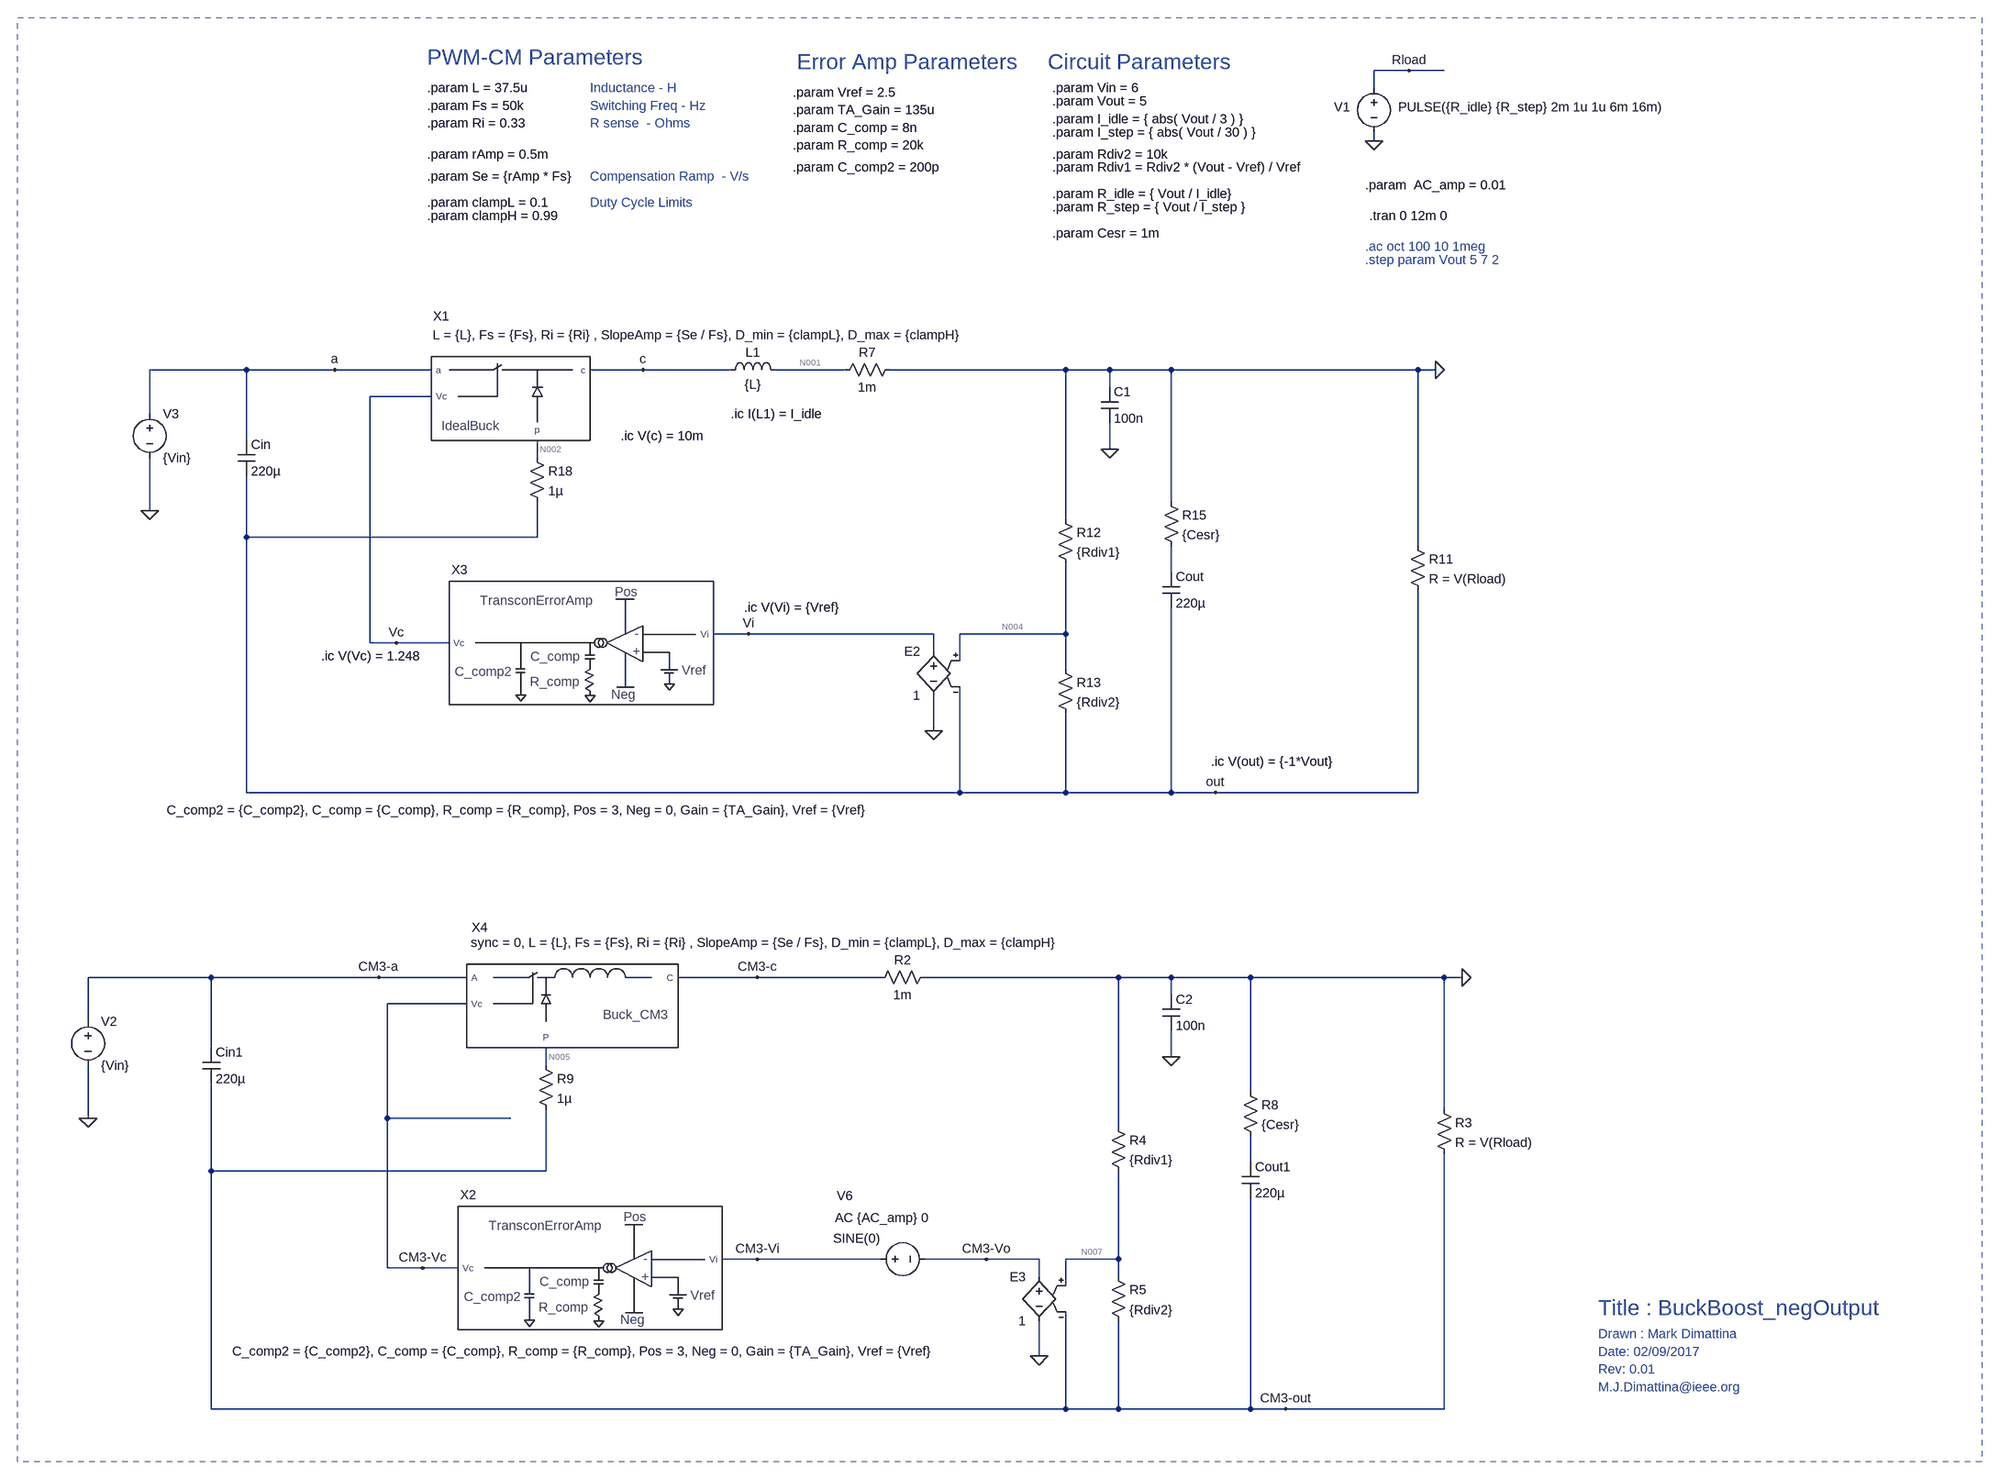
[diagram p0: schematic BuckBoost_negOutput.asc]
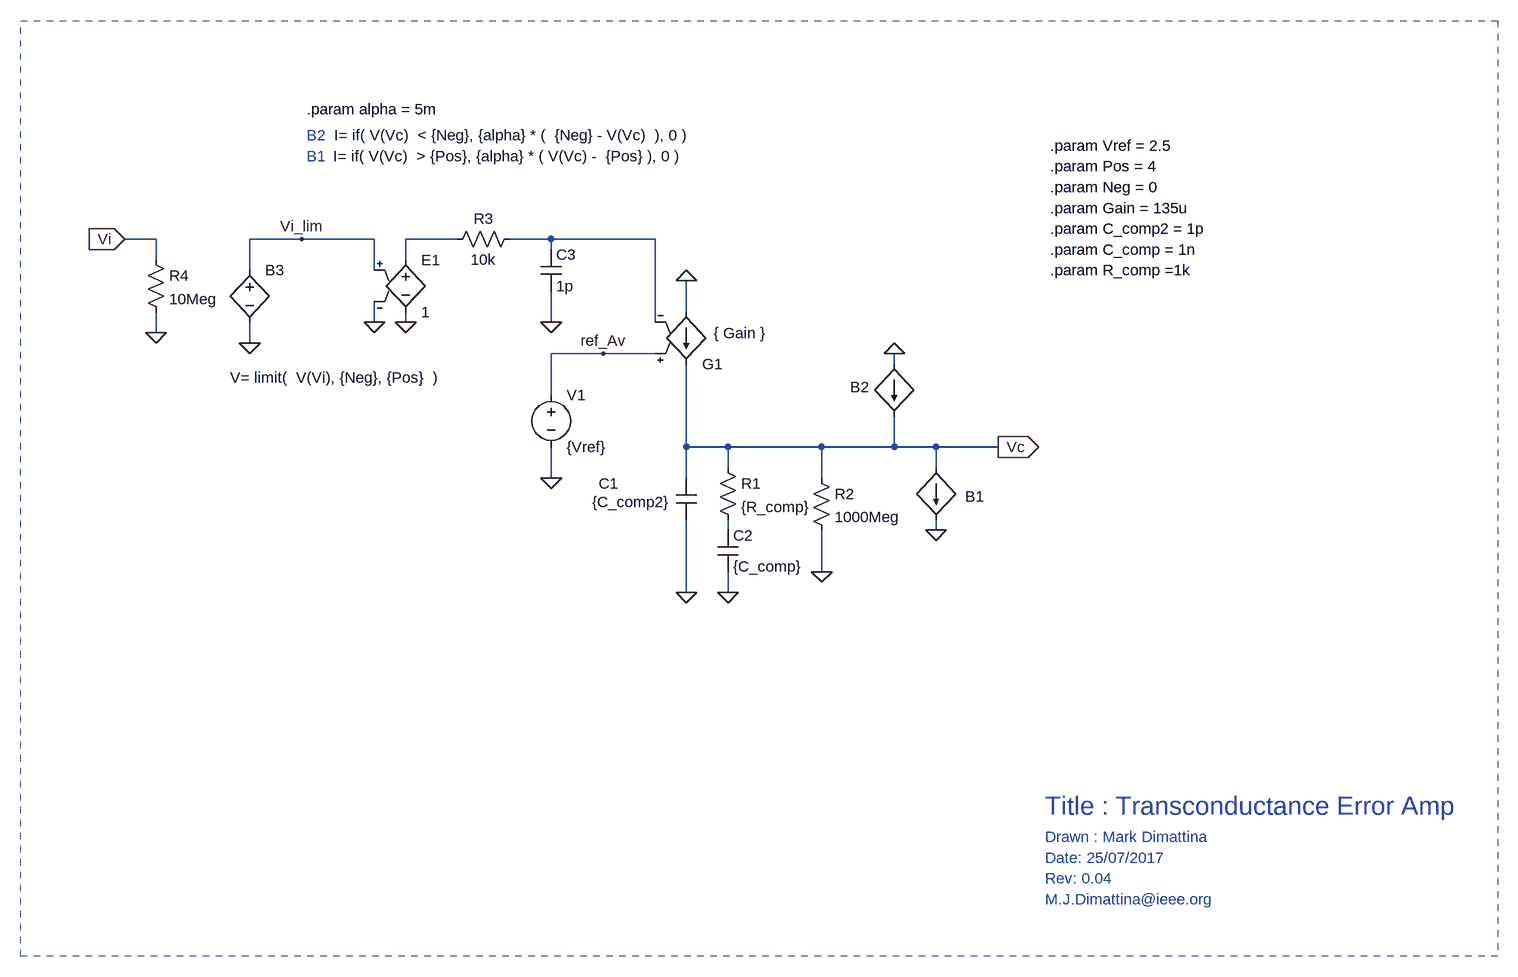
[diagram p1: sub-circuit transconerroramp.asc]
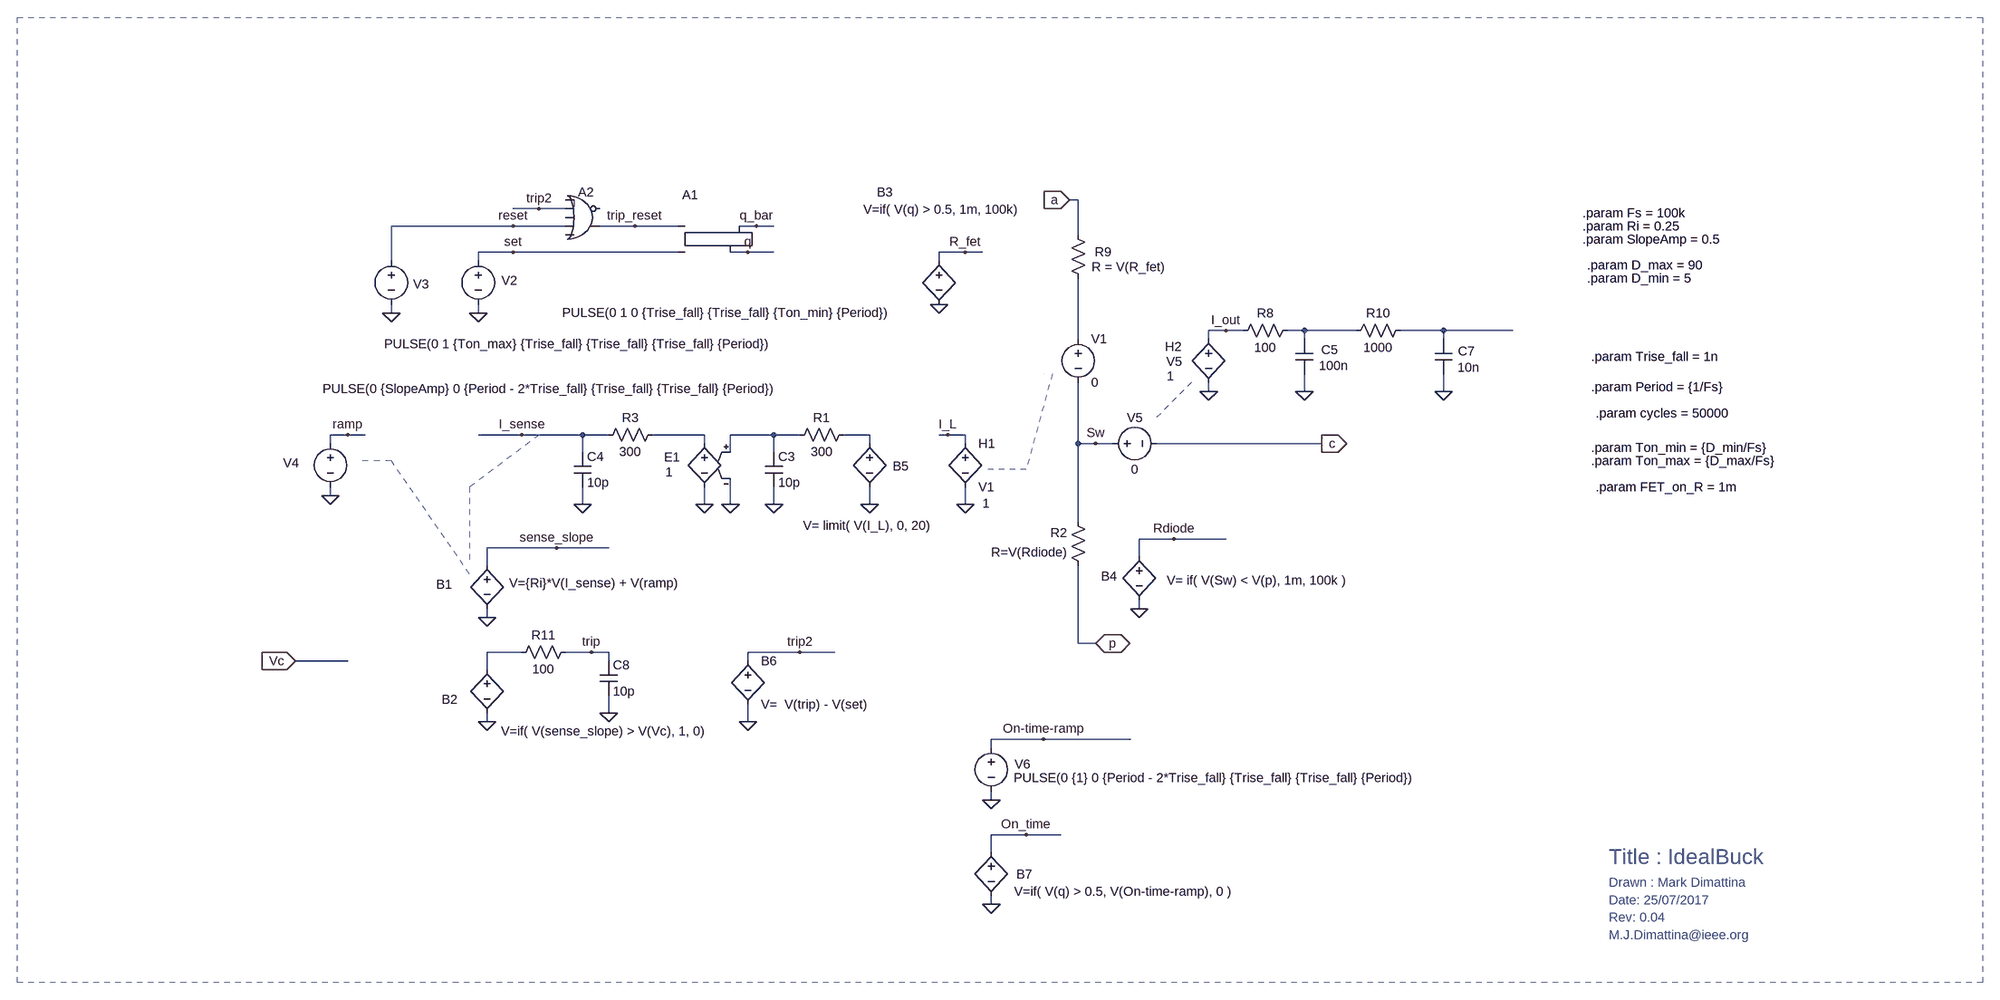
[diagram p2: sub-circuit idealbuck.asc]
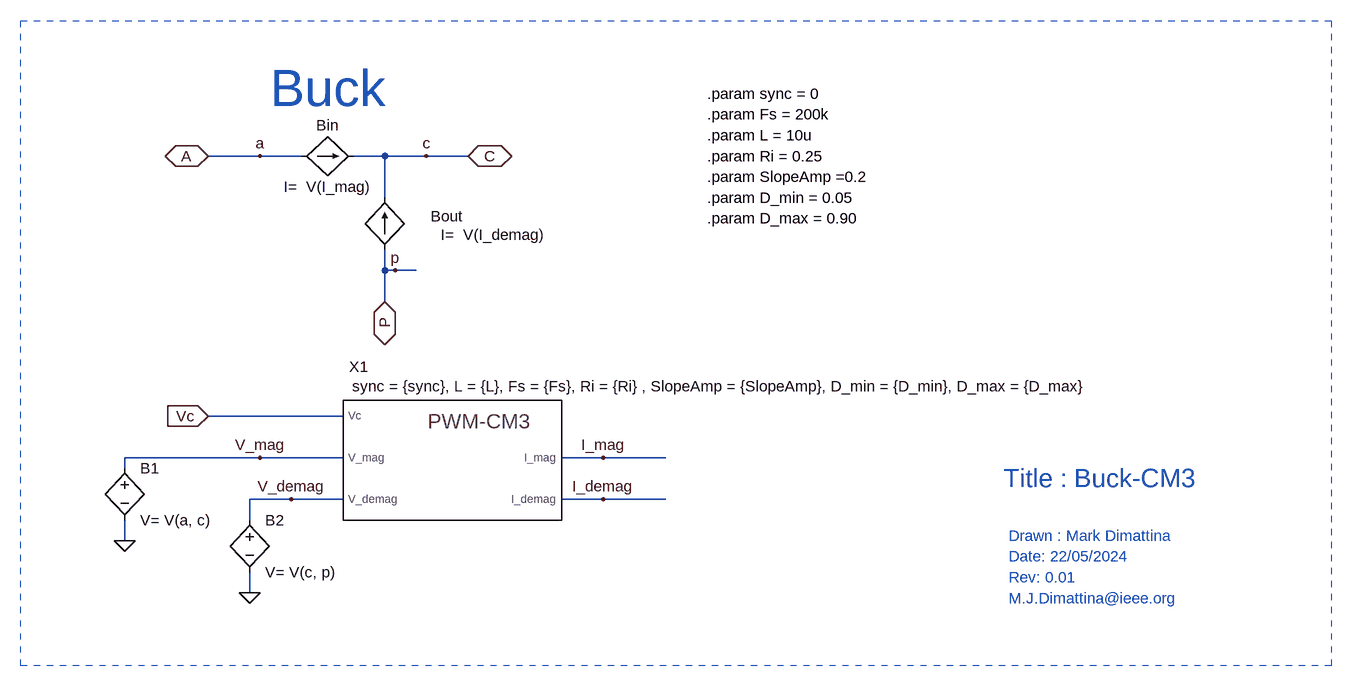
[diagram p3: sub-circuit buck_cm3.asc]
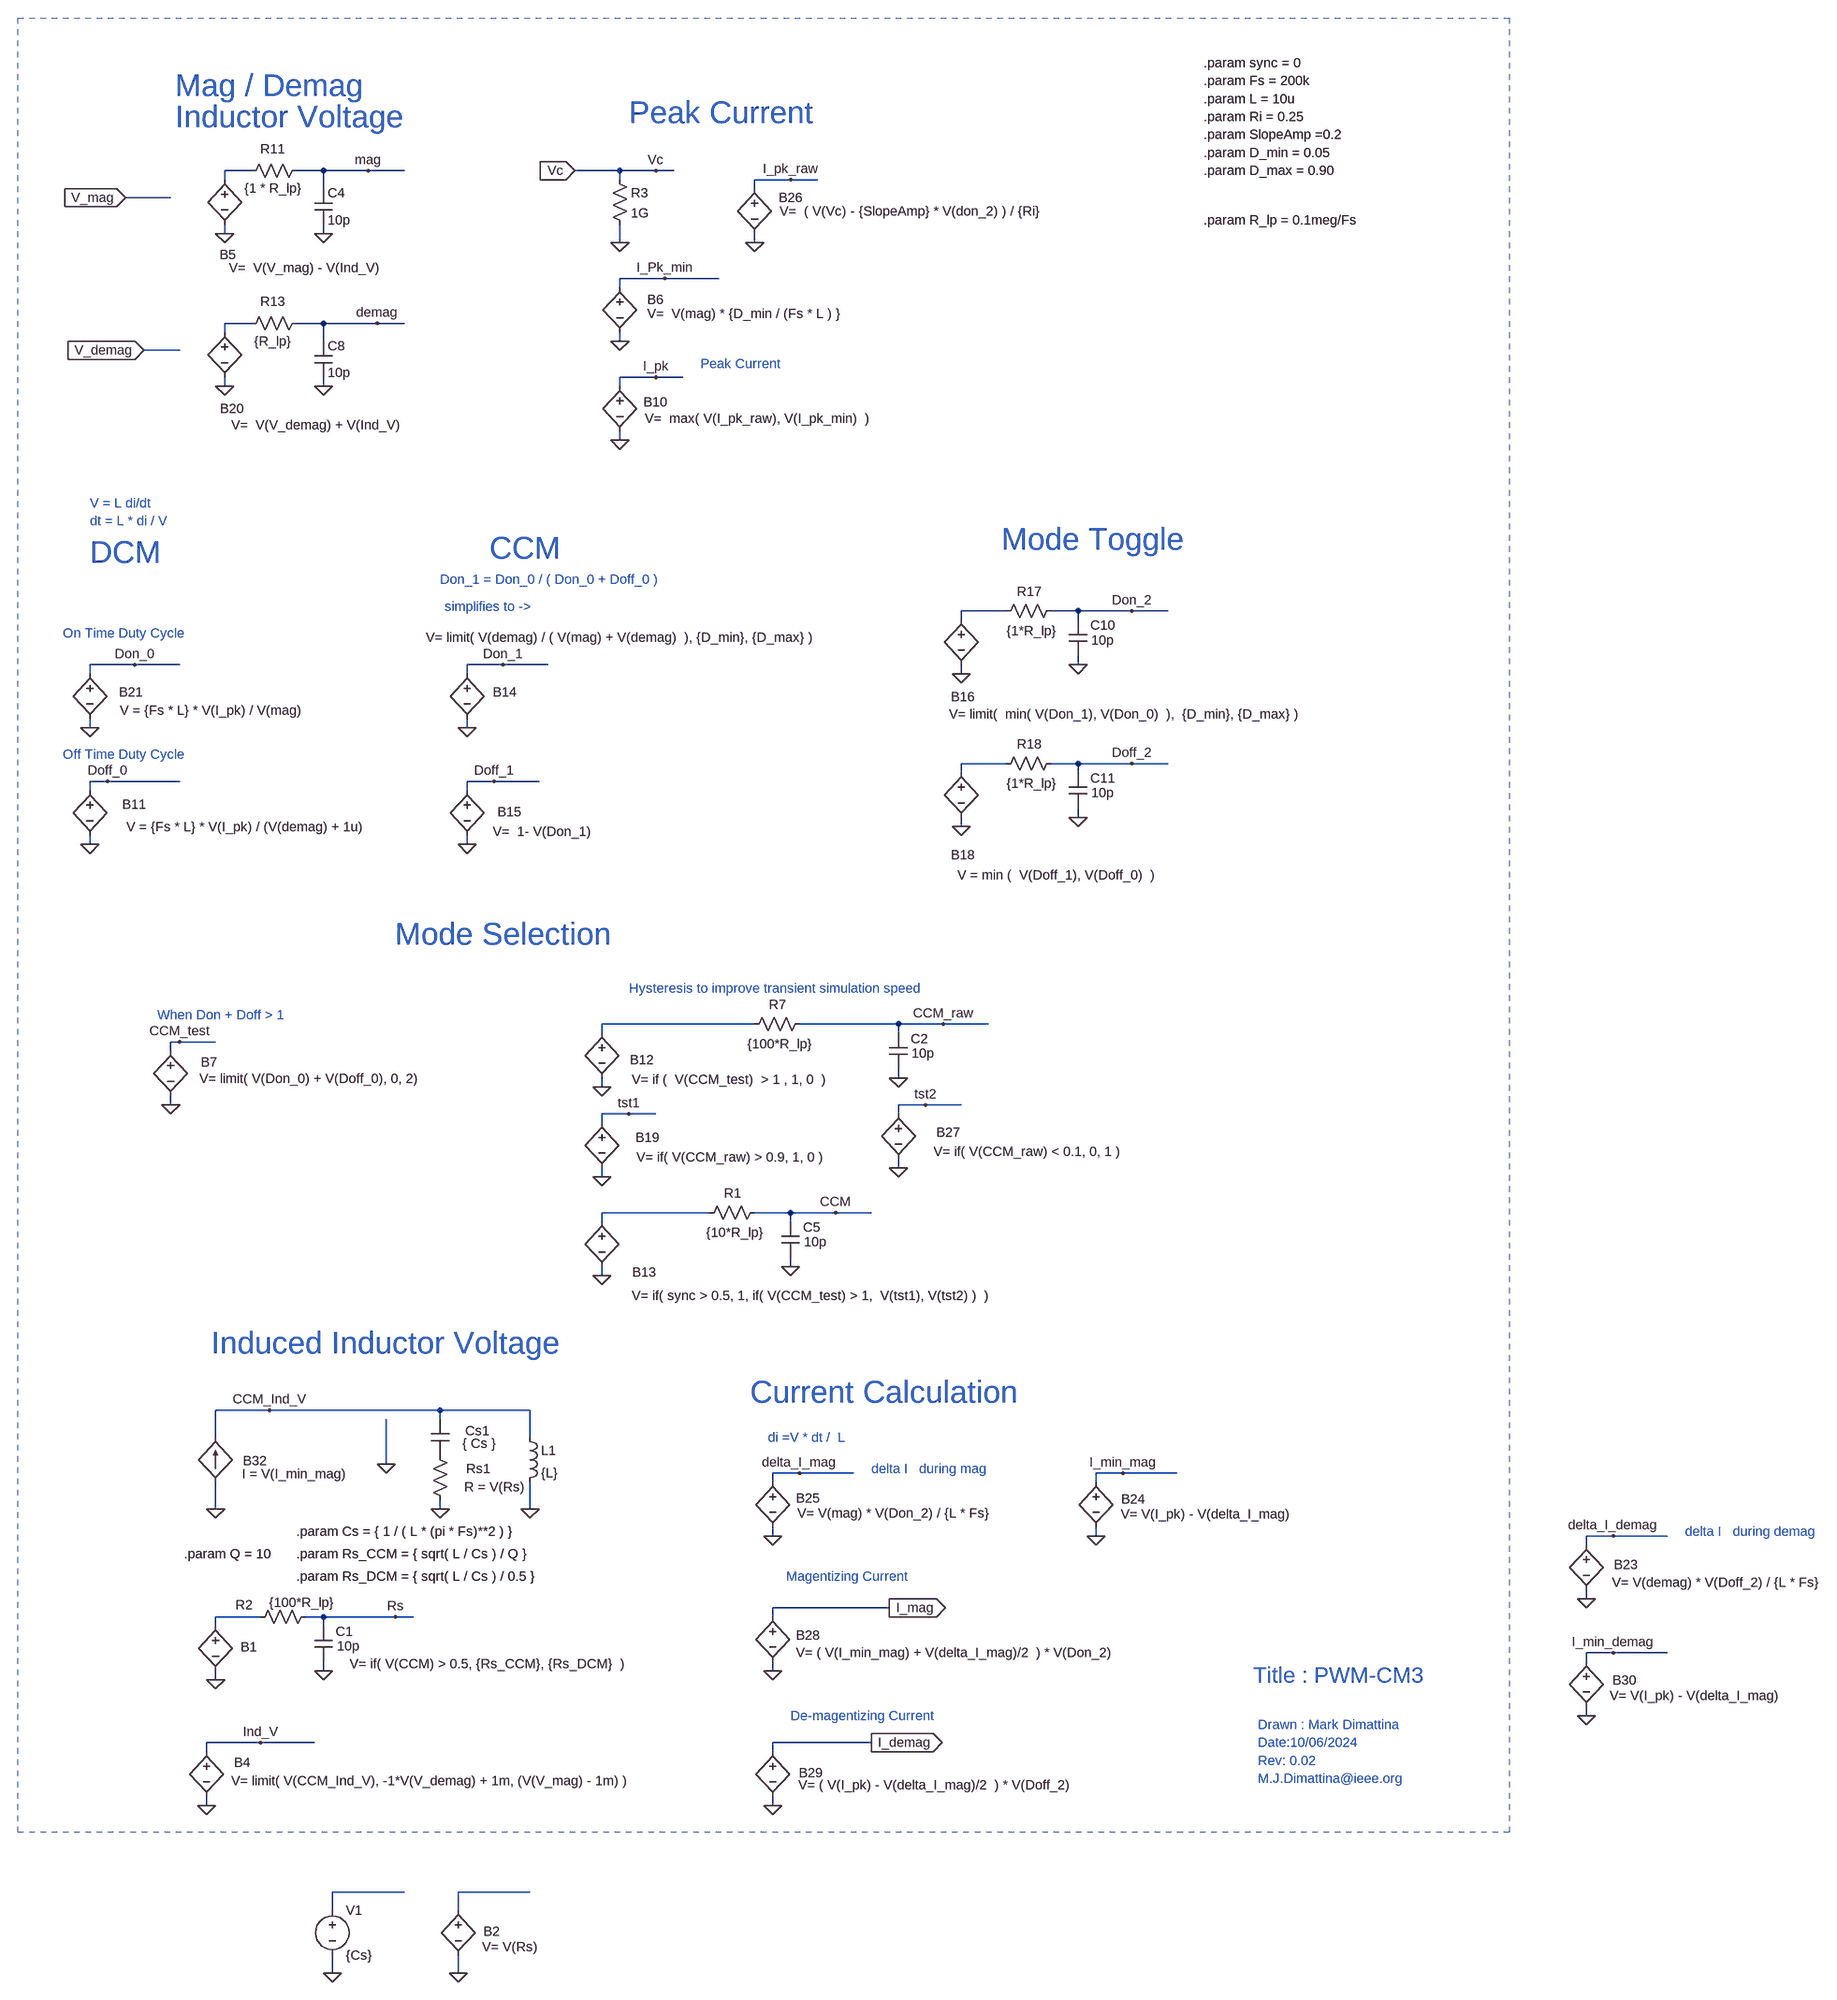
[diagram p4: sub-circuit pwm_cm3.asc]
BuckBoost_negOutput.asc, the LTspice schematic file:
Version 4
SHEET 1 6372 4964
WIRE 2976 864 2912 864
WIRE 3040 864 2976 864
WIRE 2912 896 2912 864
WIRE 2912 992 2912 976
WIRE 864 1408 688 1408
WIRE 1024 1408 864 1408
WIRE 1200 1408 1024 1408
WIRE 1584 1408 1488 1408
WIRE 1744 1408 1584 1408
WIRE 1952 1408 1824 1408
WIRE 2352 1408 2032 1408
WIRE 2432 1408 2352 1408
WIRE 2544 1408 2432 1408
WIRE 2992 1408 2544 1408
WIRE 3024 1408 2992 1408
WIRE 2432 1440 2432 1408
WIRE 1200 1456 1088 1456
WIRE 688 1488 688 1408
WIRE 864 1536 864 1408
WIRE 2432 1552 2432 1504
WIRE 1392 1568 1392 1536
WIRE 2544 1648 2544 1408
WIRE 688 1664 688 1568
WIRE 2352 1680 2352 1408
WIRE 864 1712 864 1600
WIRE 1392 1712 1392 1648
WIRE 1392 1712 864 1712
WIRE 2992 1728 2992 1408
WIRE 2544 1776 2544 1728
WIRE 1776 1888 1712 1888
WIRE 2112 1888 1776 1888
WIRE 2352 1888 2352 1760
WIRE 2352 1888 2160 1888
WIRE 1088 1904 1088 1456
WIRE 1136 1904 1088 1904
WIRE 1232 1904 1136 1904
WIRE 2112 1920 2112 1888
WIRE 2160 1936 2160 1888
WIRE 2352 1952 2352 1888
WIRE 2112 2064 2112 2000
WIRE 864 2176 864 1712
WIRE 2160 2176 2160 1984
WIRE 2160 2176 864 2176
WIRE 2352 2176 2352 2032
WIRE 2352 2176 2160 2176
WIRE 2544 2176 2544 1840
WIRE 2544 2176 2352 2176
WIRE 2624 2176 2544 2176
WIRE 2992 2176 2992 1808
WIRE 2992 2176 2624 2176
WIRE 800 2512 576 2512
WIRE 1104 2512 800 2512
WIRE 1264 2512 1104 2512
WIRE 1792 2512 1648 2512
WIRE 2016 2512 1792 2512
WIRE 2448 2512 2096 2512
WIRE 2544 2512 2448 2512
WIRE 2688 2512 2544 2512
WIRE 3040 2512 2688 2512
WIRE 3072 2512 3040 2512
WIRE 2544 2544 2544 2512
WIRE 1264 2560 1120 2560
WIRE 576 2592 576 2512
WIRE 800 2640 800 2512
WIRE 2544 2656 2544 2608
WIRE 1408 2672 1408 2640
WIRE 2688 2720 2688 2512
WIRE 3040 2752 3040 2512
WIRE 576 2768 576 2672
WIRE 1120 2768 1120 2560
WIRE 1344 2768 1120 2768
WIRE 2448 2784 2448 2512
WIRE 2688 2848 2688 2800
WIRE 800 2864 800 2704
WIRE 1408 2864 1408 2752
WIRE 1408 2864 800 2864
WIRE 1792 3024 1728 3024
WIRE 2016 3024 1792 3024
WIRE 2208 3024 2096 3024
WIRE 2304 3024 2208 3024
WIRE 2448 3024 2448 2864
WIRE 2448 3024 2352 3024
WIRE 1120 3040 1120 2768
WIRE 1184 3040 1120 3040
WIRE 1248 3040 1184 3040
WIRE 2304 3056 2304 3024
WIRE 2448 3056 2448 3024
WIRE 2352 3072 2352 3024
WIRE 2304 3200 2304 3136
WIRE 800 3296 800 2864
WIRE 2352 3296 2352 3120
WIRE 2352 3296 800 3296
WIRE 2448 3296 2448 3136
WIRE 2448 3296 2352 3296
WIRE 2688 3296 2688 2912
WIRE 2688 3296 2448 3296
WIRE 2752 3296 2688 3296
WIRE 3040 3296 3040 2832
WIRE 3040 3296 2752 3296
FLAG 1024 1408 a
FLAG 2624 2176 out
FLAG 688 1664 0
FLAG 1136 1904 Vc
FLAG 1776 1888 Vi
FLAG 2432 1552 0
FLAG 2912 992 0
FLAG 2976 864 Rload
FLAG 2112 2064 0
FLAG 3024 1408 0
FLAG 1104 2512 CM3-a
FLAG 2752 3296 CM3-out
FLAG 576 2768 0
FLAG 1184 3040 CM3-Vc
FLAG 1792 3024 CM3-Vi
FLAG 2544 2656 0
FLAG 1792 2512 CM3-c
FLAG 2304 3200 0
FLAG 3072 2512 0
FLAG 2208 3024 CM3-Vo
FLAG 1584 1408 c
DATAFLAG 1264 2768 ""
DATAFLAG 2912 3296 ""
SYMBOL ind 1728 1424 R270
WINDOW 0 32 56 VTop 2
WINDOW 3 5 56 VBottom 2
SYMATTR InstName L1
SYMATTR Value {L}
SYMATTR SpiceLine Rser=1m
SYMBOL res 2048 1392 R90
WINDOW 0 0 56 VBottom 2
WINDOW 3 32 56 VTop 2
SYMATTR InstName R7
SYMATTR Value 1m
SYMBOL cap 2528 1776 R0
SYMATTR InstName Cout
SYMATTR Value 220µ
SYMBOL res 2976 1712 R0
SYMATTR InstName R11
SYMATTR Value R = V(Rload)
SYMBOL res 2336 1664 R0
SYMATTR InstName R12
SYMATTR Value {Rdiv1}
SYMBOL res 2336 1936 R0
SYMATTR InstName R13
SYMATTR Value {Rdiv2}
SYMBOL voltage 688 1472 R0
SYMATTR InstName V3
SYMATTR Value {Vin}
SYMBOL res 2528 1632 R0
SYMATTR InstName R15
SYMATTR Value {Cesr}
SYMBOL TransconErrorAmp 1616 1824 M0
WINDOW 0 380 -53 Right 2
WINDOW 39 897 384 Right 2
SYMATTR InstName X3
SYMATTR SpiceLine C_comp2 = {C_comp2}, C_comp = {C_comp}, R_comp = {R_comp}, Pos = 3, Neg = 0, Gain = {TA_Gain}, Vref = {Vref}
SYMBOL cap 2416 1440 R0
SYMATTR InstName C1
SYMATTR Value 100n
SYMBOL voltage 2912 880 R0
WINDOW 123 0 0 Left 2
WINDOW 39 0 0 Left 2
WINDOW 0 -72 51 Left 2
WINDOW 3 44 51 Left 2
SYMATTR InstName V1
SYMATTR Value PULSE({R_idle} {R_step} 2m 1u 1u 6m 16m)
SYMBOL res 1376 1552 R0
SYMATTR InstName R18
SYMATTR Value 1µ
SYMBOL IdealBuck 1296 1440 R0
WINDOW 0 -78 -114 Bottom 2
WINDOW 39 -94 -95 Left 2
SYMATTR InstName X1
SYMATTR SpiceLine L = {L}, Fs = {Fs}, Ri = {Ri} , SlopeAmp = {Se / Fs}, D_min = {clampL}, D_max = {clampH}
SYMBOL e 2112 1904 M0
SYMATTR InstName E2
SYMATTR Value 1
SYMBOL cap 848 1536 R0
SYMATTR InstName Cin
SYMATTR Value 220µ
SYMBOL res 2112 2496 R90
WINDOW 0 0 56 VBottom 2
WINDOW 3 32 56 VTop 2
SYMATTR InstName R2
SYMATTR Value 1m
SYMBOL cap 2672 2848 R0
SYMATTR InstName Cout1
SYMATTR Value 220µ
SYMBOL res 3024 2736 R0
SYMATTR InstName R3
SYMATTR Value R = V(Rload)
SYMBOL res 2432 2768 R0
SYMATTR InstName R4
SYMATTR Value {Rdiv1}
SYMBOL res 2432 3040 R0
SYMATTR InstName R5
SYMATTR Value {Rdiv2}
SYMBOL voltage 576 2576 R0
SYMATTR InstName V2
SYMATTR Value {Vin}
SYMBOL res 2672 2704 R0
SYMATTR InstName R8
SYMATTR Value {Cesr}
SYMBOL res 1392 2656 R0
SYMATTR InstName R9
SYMATTR Value 1µ
SYMBOL TransconErrorAmp 1632 2960 M0
WINDOW 0 380 -53 Right 2
WINDOW 39 794 231 Right 2
SYMATTR InstName X2
SYMATTR SpiceLine C_comp2 = {C_comp2}, C_comp = {C_comp}, R_comp = {R_comp}, Pos = 3, Neg = 0, Gain = {TA_Gain}, Vref = {Vref}
SYMBOL voltage 2000 3024 R270
WINDOW 0 115 -64 VRight 2
WINDOW 3 38 -70 VRight 2
WINDOW 123 75 -67 VRight 2
WINDOW 39 0 0 Left 2
SYMATTR InstName V6
SYMATTR Value SINE(0)
SYMATTR Value2 AC {AC_amp} 0
SYMBOL cap 2528 2544 R0
SYMATTR InstName C2
SYMATTR Value 100n
SYMBOL e 2304 3040 M0
SYMATTR InstName E3
SYMATTR Value 1
SYMBOL cap 784 2640 R0
SYMATTR InstName Cin1
SYMATTR Value 220µ
SYMBOL Buck_CM3 1344 2544 R0
WINDOW 0 -56 -107 Bottom 2
WINDOW 39 -73 -95 Left 2
SYMATTR InstName X4
SYMATTR SpiceLine sync = 0, L = {L}, Fs = {Fs}, Ri = {Ri} , SlopeAmp = {Se / Fs}, D_min = {clampL}, D_max = {clampH}
TEXT 1192 1104 Left 2 !.param clampL = 0.1
TEXT 1192 1128 Left 2 !.param clampH = 0.99
TEXT 2896 1184 Left 2 ;.ac oct 100 10 1meg
TEXT 1192 896 Left 2 !.param L = 37.5u
TEXT 1192 928 Left 2 !.param Fs = 50k
TEXT 1192 960 Left 2 !.param Ri = 0.33
TEXT 1192 1056 Left 2 !.param Se = {rAmp * Fs}
TEXT 1488 1056 Left 2 ;Compensation Ramp  - V/s
TEXT 1488 960 Left 2 ;R sense  - Ohms
TEXT 1488 928 Left 2 ;Switching Freq - Hz
TEXT 1488 896 Left 2 ;Inductance - H
TEXT 1488 1104 Left 2 ;Duty Cycle Limits
TEXT 1192 840 Left 4 ;PWM-CM Parameters
TEXT 1856 904 Left 2 !.param Vref = 2.5
TEXT 1856 936 Left 2 !.param TA_Gain = 135u
TEXT 1856 968 Left 2 !.param C_comp = 8n
TEXT 1856 1000 Left 2 !.param R_comp = 20k
TEXT 1768 1840 Left 2 !.ic V(Vi) = {Vref}
TEXT 2616 2120 Left 2 !.ic V(out) = {-1*Vout}
TEXT 1000 1928 Left 2 !.ic V(Vc) = 1.248
TEXT 2328 952 Left 2 !.param I_idle = { abs( Vout / 3 ) }
TEXT 2328 976 Left 2 !.param I_step = { abs( Vout / 30 ) }
TEXT 2328 920 Left 2 !.param Vout = 5
TEXT 2328 1088 Left 2 !.param R_idle = { Vout / I_idle}
TEXT 2328 1112 Left 2 !.param R_step = { Vout / I_step }
TEXT 2328 896 Left 2 !.param Vin = 6
TEXT 2328 1016 Left 2 !.param Rdiv2 = 10k
TEXT 2328 1040 Left 2 !.param Rdiv1 = Rdiv2 * (Vout - Vref) / Vref
TEXT 1192 1016 Left 2 !.param rAmp = 0.5m
TEXT 1864 848 Left 4 ;Error Amp Parameters
TEXT 2320 848 Left 4 ;Circuit Parameters
TEXT 3320 3160 Left 2 ;Drawn : Mark Dimattina
TEXT 3320 3112 Left 4 ;Title : BuckBoost_negOutput
TEXT 3320 3224 Left 2 ;Rev: 0.01
TEXT 3320 3192 Left 2 ;Date: 02/09/2017
TEXT 3320 3256 Left 2 ;M.J.Dimattina@ieee.org
TEXT 1744 1488 Left 2 !.ic I(L1) = I_idle
TEXT 2896 1208 Left 2 ;.step param Vout 5 7 2
TEXT 2896 1072 Left 2 !.param  AC_amp = 0.01
TEXT 2904 1128 Left 2 !.tran 0 12m 0
TEXT 2328 1160 Left 2 !.param Cesr = 1m
TEXT 1856 1040 Left 2 !.param C_comp2 = 200p
TEXT 1544 1528 Left 2 !.ic V(c) = 10m
RECTANGLE Normal 4016 3392 448 768 2

transconerroramp.asc, the sub-circuit schematic file:
Version 4
SHEET 1 1752 1300
WIRE -560 192 -608 192
WIRE -336 192 -416 192
WIRE -224 192 -336 192
WIRE -96 192 -176 192
WIRE 48 192 -16 192
WIRE 208 192 48 192
WIRE 48 208 48 192
WIRE -560 224 -560 192
WIRE -176 224 -176 192
WIRE -416 240 -416 192
WIRE -224 240 -224 192
WIRE 256 304 256 256
WIRE -224 320 -224 288
WIRE -176 320 -176 304
WIRE 48 320 48 272
WIRE 208 320 208 192
WIRE -560 336 -560 304
WIRE -416 352 -416 320
WIRE 128 368 48 368
WIRE 208 368 128 368
WIRE 576 384 576 368
WIRE 48 432 48 368
WIRE 256 512 256 384
WIRE 320 512 256 512
WIRE 464 512 320 512
WIRE 576 512 576 464
WIRE 576 512 464 512
WIRE 640 512 576 512
WIRE 736 512 640 512
WIRE 320 544 320 512
WIRE 640 544 640 512
WIRE 48 560 48 512
WIRE 256 560 256 512
WIRE 464 560 464 512
WIRE 320 640 320 624
WIRE 640 640 640 624
WIRE 464 704 464 640
WIRE 256 736 256 624
WIRE 320 736 320 704
FLAG 48 560 0
FLAG 256 256 0
FLAG 256 736 0
FLAG 320 736 0
FLAG 128 368 ref_Av
FLAG -608 192 Vi
IOPIN -608 192 In
FLAG 736 512 Vc
IOPIN 736 512 Out
FLAG 640 640 0
FLAG 576 368 0
FLAG 464 704 0
FLAG -176 320 0
FLAG -224 320 0
FLAG 48 320 0
FLAG -416 352 0
FLAG -336 192 Vi_lim
FLAG -560 336 0
SYMBOL g 256 400 M180
WINDOW 3 42 63 Left 2
SYMATTR Value { Gain }
SYMATTR InstName G1
SYMBOL voltage 48 416 R0
SYMATTR InstName V1
SYMATTR Value {Vref}
SYMBOL cap 240 560 R0
WINDOW 3 -129 37 Left 2
WINDOW 0 -119 8 Left 2
SYMATTR Value {C_comp2}
SYMATTR InstName C1
SYMBOL cap 304 640 R0
SYMATTR InstName C2
SYMATTR Value {C_comp}
SYMBOL res 304 528 R0
SYMATTR InstName R1
SYMATTR Value {R_comp}
SYMBOL bi 640 544 R0
WINDOW 3 -927 -480 Left 2
WINDOW 0 45 44 Left 2
SYMATTR Value I= if( V(Vc)  > {Pos}, {alpha} * ( V(Vc) -  {Pos} ), 0 )
SYMATTR InstName B1
SYMBOL bi 576 384 R0
WINDOW 0 -68 36 Left 2
WINDOW 3 -862 -352 Left 2
SYMATTR InstName B2
SYMATTR Value I= if( V(Vc)  < {Neg}, {alpha} * (  {Neg} - V(Vc)  ), 0 )
SYMBOL res 448 544 R0
SYMATTR InstName R2
SYMATTR Value 1000Meg
SYMBOL cap 32 208 R0
SYMATTR InstName C3
SYMATTR Value 1p
SYMBOL res 0 176 R90
WINDOW 0 0 56 VBottom 2
WINDOW 3 32 56 VTop 2
SYMATTR InstName R3
SYMATTR Value 10k
SYMBOL e -176 208 R0
SYMATTR InstName E1
SYMATTR Value 1
SYMBOL bv -416 224 R0
WINDOW 3 -30 181 Left 2
SYMATTR Value V= limit(  V(Vi), {Neg}, {Pos}  )
SYMATTR InstName B3
SYMBOL res -576 208 R0
SYMATTR InstName R4
SYMATTR Value 10Meg
TEXT -328 -8 Left 2 !.param alpha = 5m
TEXT 816 240 Left 2 !.param R_comp =1k
TEXT 816 208 Left 2 !.param C_comp = 1n
TEXT 816 176 Left 2 !.param C_comp2 = 1p
TEXT -328 64 Left 2 ;B1
TEXT -328 32 Left 2 ;B2
TEXT 808 1112 Left 2 ;Drawn : Mark Dimattina
TEXT 808 1064 Left 4 ;Title : Transconductance Error Amp
TEXT 808 1176 Left 2 ;Rev: 0.04
TEXT 808 1144 Left 2 ;Date: 25/07/2017
TEXT 808 1208 Left 2 ;M.J.Dimattina@ieee.org
TEXT 816 80 Left 2 !.param Pos = 4
TEXT 816 112 Left 2 !.param Neg = 0
TEXT 816 48 Left 2 !.param Vref = 2.5
TEXT 816 144 Left 2 !.param Gain = 135u
RECTANGLE Normal 1504 1296 -768 -144 2

idealbuck.asc, the sub-circuit schematic file:
Version 4
SHEET 1 880 680
WIRE -912 -1456 -928 -1456
WIRE -1904 -1440 -1952 -1440
WIRE -1856 -1440 -1904 -1440
WIRE -1952 -1408 -2176 -1408
WIRE -1856 -1408 -1952 -1408
WIRE -1728 -1408 -1792 -1408
WIRE -1648 -1408 -1728 -1408
WIRE -1504 -1408 -1536 -1408
WIRE -1472 -1408 -1504 -1408
WIRE -912 -1392 -912 -1456
WIRE -1952 -1360 -2016 -1360
WIRE -1648 -1360 -1952 -1360
WIRE -1520 -1360 -1552 -1360
WIRE -1472 -1360 -1520 -1360
WIRE -1120 -1360 -1168 -1360
WIRE -1088 -1360 -1120 -1360
WIRE -2176 -1344 -2176 -1408
WIRE -2016 -1344 -2016 -1360
WIRE -1168 -1344 -1168 -1360
WIRE -2176 -1248 -2176 -1264
WIRE -2016 -1248 -2016 -1264
WIRE -640 -1216 -672 -1216
WIRE -608 -1216 -640 -1216
WIRE -496 -1216 -528 -1216
WIRE -400 -1216 -496 -1216
WIRE -240 -1216 -320 -1216
WIRE -112 -1216 -240 -1216
WIRE -912 -1200 -912 -1312
WIRE -672 -1200 -672 -1216
WIRE -496 -1200 -496 -1216
WIRE -240 -1200 -240 -1216
WIRE -672 -1104 -672 -1120
WIRE -496 -1104 -496 -1136
WIRE -240 -1104 -240 -1136
WIRE -2256 -1024 -2288 -1024
WIRE -2224 -1024 -2256 -1024
WIRE -1936 -1024 -2016 -1024
WIRE -1824 -1024 -1936 -1024
WIRE -1776 -1024 -1824 -1024
WIRE -1600 -1024 -1696 -1024
WIRE -1472 -1024 -1552 -1024
WIRE -1424 -1024 -1472 -1024
WIRE -1296 -1024 -1344 -1024
WIRE -1152 -1024 -1168 -1024
WIRE -1120 -1024 -1152 -1024
WIRE -2288 -1008 -2288 -1024
WIRE -1600 -1008 -1600 -1024
WIRE -1296 -1008 -1296 -1024
WIRE -1120 -1008 -1120 -1024
WIRE -912 -1008 -912 -1120
WIRE -880 -1008 -912 -1008
WIRE -848 -1008 -880 -1008
WIRE -464 -1008 -768 -1008
WIRE -1824 -992 -1824 -1024
WIRE -1552 -992 -1552 -1024
WIRE -1472 -992 -1472 -1024
WIRE -2288 -912 -2288 -928
WIRE -1824 -896 -1824 -928
WIRE -1600 -896 -1600 -928
WIRE -1552 -896 -1552 -944
WIRE -1472 -896 -1472 -928
WIRE -1296 -896 -1296 -928
WIRE -1120 -896 -1120 -928
WIRE -912 -864 -912 -1008
WIRE -736 -832 -800 -832
WIRE -640 -832 -736 -832
WIRE -1872 -816 -2000 -816
WIRE -1776 -816 -1872 -816
WIRE -800 -800 -800 -832
WIRE -2000 -784 -2000 -816
WIRE -800 -704 -800 -720
WIRE -2000 -688 -2000 -704
WIRE -912 -640 -912 -784
WIRE -880 -640 -912 -640
WIRE -1936 -624 -2000 -624
WIRE -1808 -624 -1856 -624
WIRE -1776 -624 -1808 -624
WIRE -1424 -624 -1520 -624
WIRE -1360 -624 -1424 -624
WIRE -2256 -608 -2352 -608
WIRE -1776 -608 -1776 -624
WIRE -1520 -608 -1520 -624
WIRE -2000 -592 -2000 -624
WIRE -1776 -512 -1776 -544
WIRE -2000 -496 -2000 -512
WIRE -1520 -496 -1520 -528
WIRE -976 -464 -1072 -464
WIRE -816 -464 -976 -464
WIRE -1072 -448 -1072 -464
WIRE -1072 -352 -1072 -368
WIRE -1008 -288 -1072 -288
WIRE -944 -288 -1008 -288
WIRE -1072 -256 -1072 -288
WIRE -1072 -160 -1072 -176
FLAG -928 -1456 a
IOPIN -928 -1456 In
FLAG -1120 -896 0
FLAG -2016 -1248 0
FLAG -2176 -1248 0
FLAG -1952 -1408 reset
FLAG -1952 -1360 set
FLAG -1728 -1408 trip_reset
FLAG -464 -1008 c
IOPIN -464 -1008 Out
FLAG -1520 -1360 q
FLAG -672 -1104 0
FLAG -496 -1104 0
FLAG -880 -640 p
IOPIN -880 -640 BiDir
FLAG -880 -1008 Sw
FLAG -1872 -816 sense_slope
FLAG -640 -1216 I_out
FLAG -240 -1104 0
FLAG -2352 -608 Vc
IOPIN -2352 -608 In
FLAG -1504 -1408 q_bar
FLAG -2000 -496 0
FLAG -1776 -512 0
FLAG -1808 -624 trip
FLAG -1904 -1440 trip2
FLAG -1168 -1264 0
FLAG -2288 -912 0
FLAG -2256 -1024 ramp
FLAG -2000 -688 0
FLAG -800 -704 0
FLAG -736 -832 Rdiode
FLAG -1936 -1024 I_sense
FLAG -1472 -896 0
FLAG -1824 -896 0
FLAG -1600 -896 0
FLAG -1552 -896 0
FLAG -1152 -1024 I_L
FLAG -1296 -896 0
FLAG -1520 -496 0
FLAG -1424 -624 trip2
FLAG -1072 -160 0
FLAG -1008 -288 On_time
FLAG -1072 -352 0
FLAG -976 -464 On-time-ramp
FLAG -1120 -1360 R_fet
SYMBOL h -1120 -1024 R0
WINDOW 123 32 126 Left 2
SYMATTR Value2 1
SYMATTR InstName H1
SYMATTR Value V1
SYMBOL voltage -912 -1216 R0
SYMATTR InstName V1
SYMATTR Value 0
SYMBOL srflop -1600 -1312 M180
WINDOW 0 -41 153 Left 2
SYMATTR InstName A1
SYMBOL voltage -2016 -1360 M0
WINDOW 3 -757 111 Left 2
WINDOW 123 0 0 Left 2
WINDOW 39 0 0 Left 2
WINDOW 0 -72 52 Left 2
SYMATTR Value PULSE(0 1 0 {Trise_fall} {Trise_fall} {Ton_min} {Period})
SYMATTR InstName V2
SYMBOL voltage -2176 -1360 R0
WINDOW 123 0 0 Left 2
WINDOW 39 0 0 Left 2
WINDOW 3 -13 169 Left 2
WINDOW 0 40 59 Left 2
SYMATTR Value PULSE(0 1 {Ton_max} {Trise_fall} {Trise_fall} {Trise_fall} {Period})
SYMATTR InstName V3
SYMBOL h -672 -1216 R0
WINDOW 123 -77 84 Left 2
WINDOW 0 -80 30 Left 2
WINDOW 3 -78 57 Left 2
SYMATTR Value2 1
SYMATTR InstName H2
SYMATTR Value V5
SYMBOL res -512 -1232 R90
WINDOW 0 0 56 VBottom 2
WINDOW 3 32 56 VTop 2
SYMATTR InstName R8
SYMATTR Value 100
SYMBOL cap -512 -1200 R0
WINDOW 0 47 20 Left 2
WINDOW 3 43 49 Left 2
SYMATTR InstName C5
SYMATTR Value 100n
SYMBOL voltage -2288 -1024 R0
WINDOW 3 -14 -85 Left 2
WINDOW 123 0 0 Left 2
WINDOW 39 0 0 Left 2
WINDOW 0 -87 52 Left 2
SYMATTR Value PULSE(0 {SlopeAmp} 0 {Period - 2*Trise_fall} {Trise_fall} {Trise_fall} {Period})
SYMATTR InstName V4
SYMBOL res -896 -1296 R180
WINDOW 0 -45 64 Left 2
WINDOW 3 -144 37 Left 2
SYMATTR InstName R9
SYMATTR Value R = V(R_fet)
SYMBOL bv -2000 -800 R0
WINDOW 0 -93 51 Left 2
WINDOW 3 41 49 Left 2
SYMATTR InstName B1
SYMATTR Value V={Ri}*V(I_sense) + V(ramp)
SYMBOL voltage -864 -1008 R270
WINDOW 0 32 56 VTop 2
WINDOW 3 -32 56 VBottom 2
SYMATTR InstName V5
SYMATTR Value 0
SYMBOL res -304 -1232 R90
WINDOW 0 0 56 VBottom 2
WINDOW 3 32 56 VTop 2
SYMATTR InstName R10
SYMATTR Value 1000
SYMBOL cap -256 -1200 R0
WINDOW 0 43 22 Left 2
WINDOW 3 42 52 Left 2
SYMATTR InstName C7
SYMATTR Value 10n
SYMBOL Digital\\or -1824 -1360 M180
WINDOW 0 -8 110 Left 2
SYMATTR InstName A2
SYMBOL bv -2000 -608 R0
WINDOW 0 -83 71 Left 2
WINDOW 3 26 129 Left 2
SYMATTR InstName B2
SYMATTR Value V=if( V(sense_slope) > V(Vc), 1, 0)
SYMBOL res -1840 -640 R90
WINDOW 0 0 56 VBottom 2
WINDOW 3 32 56 VTop 2
SYMATTR InstName R11
SYMATTR Value 100
SYMBOL cap -1792 -608 R0
SYMATTR InstName C8
SYMATTR Value 10p
SYMBOL bv -1168 -1360 R0
WINDOW 0 -114 -110 Left 2
WINDOW 3 -139 -79 Left 2
SYMATTR InstName B3
SYMATTR Value V=if( V(q) > 0.5, 1m, 100k)
SYMBOL res -896 -768 R180
WINDOW 0 36 76 Left 2
WINDOW 3 36 40 Left 2
SYMATTR InstName R2
SYMATTR Value R=V(Rdiode)
SYMBOL bv -800 -816 R0
WINDOW 0 -70 52 Left 2
WINDOW 3 51 60 Left 2
SYMATTR InstName B4
SYMATTR Value V= if( V(Sw) < V(p), 1m, 100k )
SYMBOL res -1328 -1040 R90
WINDOW 0 0 56 VBottom 2
WINDOW 3 32 56 VTop 2
SYMATTR InstName R1
SYMATTR Value 300
SYMBOL cap -1488 -992 R0
SYMATTR InstName C3
SYMATTR Value 10p
SYMBOL e -1600 -1024 M0
WINDOW 0 45 41 Left 2
WINDOW 3 58 69 Left 2
SYMATTR InstName E1
SYMATTR Value 1
SYMBOL res -1680 -1040 R90
WINDOW 0 0 56 VBottom 2
WINDOW 3 32 56 VTop 2
SYMATTR InstName R3
SYMATTR Value 300
SYMBOL cap -1840 -992 R0
SYMATTR InstName C4
SYMATTR Value 10p
SYMBOL bv -1296 -1024 R0
WINDOW 3 -122 167 Left 2
WINDOW 0 43 58 Left 2
SYMATTR Value V= limit( V(I_L), 0, 20)
SYMATTR InstName B5
SYMBOL bv -1520 -624 R0
SYMATTR InstName B6
SYMATTR Value V=  V(trip) - V(set)
SYMBOL bv -1072 -272 R0
WINDOW 0 46 57 Left 2
WINDOW 3 42 88 Left 2
SYMATTR InstName B7
SYMATTR Value V=if( V(q) > 0.5, V(On-time-ramp), 0 )
SYMBOL voltage -1072 -464 R0
WINDOW 3 41 71 Left 2
WINDOW 123 0 0 Left 2
WINDOW 39 0 0 Left 2
WINDOW 0 43 46 Left 2
SYMATTR Value PULSE(0 {1} 0 {Period - 2*Trise_fall} {Trise_fall} {Trise_fall} {Period})
SYMATTR InstName V6
TEXT 16 -1384 Left 2 !.param SlopeAmp = 0.5
TEXT 32 -1168 Left 2 !.param Trise_fall = 1n
TEXT 16 -1432 Left 2 !.param Fs = 100k
TEXT 32 -1112 Left 2 !.param Period = {1/Fs}
TEXT 40 -1064 Left 2 !.param cycles = 50000
TEXT 32 -1000 Left 2 !.param Ton_min = {D_min/Fs}
TEXT 32 -976 Left 2 !.param Ton_max = {D_max/Fs}
TEXT 24 -1312 Left 2 !.param D_min = 5
TEXT 24 -1336 Left 2 !.param D_max = 90
TEXT 16 -1408 Left 2 !.param Ri = 0.25
TEXT 40 -928 Left 2 !.param FET_on_R = 1m
TEXT 64 -200 Left 2 ;Drawn : Mark Dimattina
TEXT 64 -248 Left 4 ;Title : IdealBuck
TEXT 64 -136 Left 2 ;Rev: 0.04
TEXT 64 -168 Left 2 ;Date: 25/07/2017
TEXT 64 -104 Left 2 ;M.J.Dimattina@ieee.org
LINE Normal -1008 -960 -1088 -960 2
LINE Normal -960 -1136 -1008 -960 2
LINE Normal -976 -1136 -976 -1136 2
LINE Normal -704 -1120 -768 -1056 2
LINE Normal -2032 -928 -2032 -784 2
LINE Normal -1904 -1024 -2032 -928 2
LINE Normal -2176 -976 -2240 -976 2
LINE Normal -2032 -768 -2176 -976 2
RECTANGLE Normal 752 -16 -2864 -1792 2

buck_cm3.asc, the sub-circuit schematic file:
Version 4
SHEET 1 3748 852
WIRE -1872 -2512 -1952 -2512
WIRE -1808 -2512 -1872 -2512
WIRE -1680 -2512 -1728 -2512
WIRE -1616 -2512 -1680 -2512
WIRE -1552 -2512 -1616 -2512
WIRE -1680 -2448 -1680 -2512
WIRE -1680 -2336 -1680 -2368
WIRE -1664 -2336 -1680 -2336
WIRE -1632 -2336 -1664 -2336
WIRE -1680 -2288 -1680 -2336
WIRE -1744 -2112 -1952 -2112
WIRE -1872 -2048 -2080 -2048
WIRE -1744 -2048 -1872 -2048
WIRE -1344 -2048 -1408 -2048
WIRE -1248 -2048 -1344 -2048
WIRE -2080 -2032 -2080 -2048
WIRE -1824 -1984 -1888 -1984
WIRE -1744 -1984 -1824 -1984
WIRE -1344 -1984 -1408 -1984
WIRE -1248 -1984 -1344 -1984
WIRE -1888 -1952 -1888 -1984
WIRE -2080 -1920 -2080 -1952
WIRE -1888 -1840 -1888 -1872
FLAG -1952 -2512 A
IOPIN -1952 -2512 BiDir
FLAG -1664 -2336 p
FLAG -1552 -2512 C
IOPIN -1552 -2512 BiDir
FLAG -1680 -2288 P
IOPIN -1680 -2288 BiDir
FLAG -1616 -2512 c
FLAG -1872 -2512 a
FLAG -1952 -2112 Vc
IOPIN -1952 -2112 In
FLAG -2080 -1920 0
FLAG -1888 -1840 0
FLAG -1344 -2048 I_mag
FLAG -1344 -1984 I_demag
FLAG -1872 -2048 V_mag
FLAG -1824 -1984 V_demag
SYMBOL bi -1808 -2512 R270
WINDOW 0 32 40 VTop 2
WINDOW 3 -32 40 VBottom 2
SYMATTR InstName Bin
SYMATTR Value I=  V(I_mag)
SYMBOL bi -1680 -2368 R180
WINDOW 0 -120 51 Left 2
WINDOW 3 -247 23 Left 2
SYMATTR InstName Bout
SYMATTR Value I=  V(I_demag)
SYMBOL PWM_CM3 -1584 -2048 R0
WINDOW 0 -136 -124 Bottom 2
WINDOW 39 -146 -110 Left 2
SYMATTR InstName X1
SYMATTR SpiceLine sync = {sync}, L = {L}, Fs = {Fs}, Ri = {Ri} , SlopeAmp = {SlopeAmp}, D_min = {D_min}, D_max = {D_max}
SYMBOL bv -2080 -2048 R0
SYMATTR InstName B1
SYMATTR Value V= V(a, c)
SYMBOL bv -1888 -1968 R0
SYMATTR InstName B2
SYMATTR Value V= V(c, p)
TEXT -1184 -2544 Left 2 !.param L = 10u
TEXT -1184 -2576 Left 2 !.param Fs = 200k
TEXT -1184 -2448 Left 2 !.param D_min = 0.05
TEXT -1184 -2416 Left 2 !.param D_max = 0.90
TEXT -1184 -2480 Left 2 !.param SlopeAmp =0.2
TEXT -1184 -2512 Left 2 !.param Ri = 0.25
TEXT -1184 -2608 Left 2 !.param sync = 0
TEXT -720 -1928 Left 2 ;Drawn : Mark Dimattina
TEXT -728 -2016 Left 4 ;Title : Buck-CM3
TEXT -720 -1864 Left 2 ;Rev: 0.01
TEXT -720 -1896 Left 2 ;Date: 22/05/2024
TEXT -720 -1832 Left 2 ;M.J.Dimattina@ieee.org
TEXT -1856 -2616 Left 6 ;Buck
RECTANGLE Normal -224 -1728 -2240 -2720 2

pwm_cm3.asc, the sub-circuit schematic file:
Version 4
SHEET 1 4220 852
WIRE -1600 -4432 -1648 -4432
WIRE -1472 -4432 -1520 -4432
WIRE -1392 -4432 -1472 -4432
WIRE -1328 -4432 -1392 -4432
WIRE -944 -4432 -1024 -4432
WIRE -880 -4432 -944 -4432
WIRE -848 -4432 -880 -4432
WIRE -1648 -4416 -1648 -4432
WIRE -944 -4416 -944 -4432
WIRE -640 -4416 -704 -4416
WIRE -592 -4416 -640 -4416
WIRE -1472 -4400 -1472 -4432
WIRE -704 -4400 -704 -4416
WIRE -1744 -4384 -1824 -4384
WIRE -1648 -4320 -1648 -4336
WIRE -1472 -4320 -1472 -4336
WIRE -944 -4304 -944 -4336
WIRE -704 -4304 -704 -4320
WIRE -864 -4240 -944 -4240
WIRE -768 -4240 -864 -4240
WIRE -944 -4224 -944 -4240
WIRE -1600 -4160 -1648 -4160
WIRE -1472 -4160 -1520 -4160
WIRE -1376 -4160 -1472 -4160
WIRE -1328 -4160 -1376 -4160
WIRE -1648 -4144 -1648 -4160
WIRE -1472 -4128 -1472 -4160
WIRE -944 -4128 -944 -4144
WIRE -1728 -4112 -1792 -4112
WIRE -880 -4064 -944 -4064
WIRE -832 -4064 -880 -4064
WIRE -1648 -4048 -1648 -4064
WIRE -1472 -4048 -1472 -4064
WIRE -944 -4048 -944 -4064
WIRE -944 -3952 -944 -3968
WIRE -256 -3648 -336 -3648
WIRE -128 -3648 -176 -3648
WIRE -32 -3648 -128 -3648
WIRE 32 -3648 -32 -3648
WIRE -336 -3632 -336 -3648
WIRE -128 -3632 -128 -3648
WIRE -1808 -3552 -1888 -3552
WIRE -1728 -3552 -1808 -3552
WIRE -1152 -3552 -1216 -3552
WIRE -1072 -3552 -1152 -3552
WIRE -128 -3552 -128 -3568
WIRE -1888 -3536 -1888 -3552
WIRE -1216 -3536 -1216 -3552
WIRE -336 -3536 -336 -3552
WIRE -1888 -3440 -1888 -3456
WIRE -1216 -3440 -1216 -3456
WIRE -256 -3376 -336 -3376
WIRE -128 -3376 -176 -3376
WIRE -32 -3376 -128 -3376
WIRE 32 -3376 -32 -3376
WIRE -336 -3360 -336 -3376
WIRE -128 -3360 -128 -3376
WIRE -1856 -3344 -1888 -3344
WIRE -1728 -3344 -1856 -3344
WIRE -1168 -3344 -1216 -3344
WIRE -1088 -3344 -1168 -3344
WIRE -1888 -3328 -1888 -3344
WIRE -1216 -3328 -1216 -3344
WIRE -128 -3280 -128 -3296
WIRE -336 -3264 -336 -3280
WIRE -1888 -3232 -1888 -3248
WIRE -1216 -3232 -1216 -3248
WIRE -704 -2912 -976 -2912
WIRE -448 -2912 -624 -2912
WIRE -368 -2912 -448 -2912
WIRE -288 -2912 -368 -2912
WIRE -976 -2896 -976 -2912
WIRE -448 -2896 -448 -2912
WIRE -1728 -2880 -1744 -2880
WIRE -1664 -2880 -1728 -2880
WIRE -1744 -2864 -1744 -2880
WIRE -448 -2816 -448 -2832
WIRE -976 -2800 -976 -2816
WIRE -1744 -2768 -1744 -2784
WIRE -400 -2768 -448 -2768
WIRE -336 -2768 -400 -2768
WIRE -928 -2752 -976 -2752
WIRE -880 -2752 -928 -2752
WIRE -448 -2752 -448 -2768
WIRE -976 -2736 -976 -2752
WIRE -448 -2656 -448 -2672
WIRE -976 -2640 -976 -2656
WIRE -784 -2576 -976 -2576
WIRE -640 -2576 -704 -2576
WIRE -560 -2576 -640 -2576
WIRE -496 -2576 -560 -2576
WIRE -976 -2560 -976 -2576
WIRE -640 -2560 -640 -2576
WIRE -640 -2480 -640 -2496
WIRE -976 -2464 -976 -2480
WIRE -1568 -2224 -1664 -2224
WIRE -1264 -2224 -1568 -2224
WIRE -1104 -2224 -1264 -2224
WIRE -1264 -2208 -1264 -2224
WIRE -1664 -2176 -1664 -2224
WIRE -1104 -2176 -1104 -2224
WIRE -1360 -2128 -1360 -2208
WIRE -624 -2112 -672 -2112
WIRE -528 -2112 -624 -2112
WIRE -48 -2112 -96 -2112
WIRE 48 -2112 -48 -2112
WIRE -672 -2096 -672 -2112
WIRE -96 -2096 -96 -2112
WIRE -1664 -2048 -1664 -2096
WIRE -1264 -2048 -1264 -2064
WIRE -1104 -2048 -1104 -2096
WIRE -672 -2000 -672 -2016
WIRE -96 -2000 -96 -2016
WIRE 832 -2000 784 -2000
WIRE 928 -2000 832 -2000
WIRE 784 -1984 784 -2000
WIRE 784 -1888 784 -1904
WIRE -464 -1872 -672 -1872
WIRE -1584 -1856 -1664 -1856
WIRE -1472 -1856 -1504 -1856
WIRE -1344 -1856 -1472 -1856
WIRE -1312 -1856 -1344 -1856
WIRE -672 -1856 -672 -1872
WIRE -1664 -1840 -1664 -1856
WIRE -1472 -1840 -1472 -1856
WIRE 832 -1792 784 -1792
WIRE 928 -1792 832 -1792
WIRE 784 -1776 784 -1792
WIRE -1472 -1760 -1472 -1776
WIRE -672 -1760 -672 -1776
WIRE -1664 -1744 -1664 -1760
WIRE 784 -1680 784 -1696
WIRE -1584 -1632 -1680 -1632
WIRE -1488 -1632 -1584 -1632
WIRE -496 -1632 -672 -1632
WIRE -1680 -1616 -1680 -1632
WIRE -672 -1616 -672 -1632
WIRE -1680 -1520 -1680 -1536
WIRE -672 -1520 -672 -1536
WIRE -1328 -1312 -1456 -1312
WIRE -1104 -1312 -1232 -1312
WIRE -1456 -1280 -1456 -1312
WIRE -1232 -1280 -1232 -1312
WIRE -1456 -1168 -1456 -1200
WIRE -1232 -1168 -1232 -1200
FLAG -944 -4304 0
FLAG -1024 -4432 Vc
IOPIN -1024 -4432 In
FLAG -880 -4432 Vc
FLAG -880 -4064 I_pk
FLAG -944 -4128 0
FLAG -864 -4240 I_Pk_min
FLAG -944 -3952 0
FLAG -704 -4304 0
FLAG -640 -4416 I_pk_raw
FLAG -1888 -3440 0
FLAG -1808 -3552 Don_0
FLAG -1888 -3232 0
FLAG -976 -2800 0
FLAG -560 -2576 CCM
FLAG -448 -2816 0
FLAG -1216 -3440 0
FLAG -1216 -3232 0
FLAG -1168 -3344 Doff_1
FLAG -336 -3536 0
FLAG -32 -3648 Don_2
FLAG -128 -3552 0
FLAG -336 -3264 0
FLAG -32 -3376 Doff_2
FLAG -128 -3280 0
FLAG 784 -1888 0
FLAG 832 -2000 delta_I_demag
FLAG -96 -2000 0
FLAG -48 -2112 I_min_mag
FLAG -672 -2000 0
FLAG -624 -2112 delta_I_mag
FLAG -672 -1760 0
FLAG -464 -1872 I_mag
IOPIN -464 -1872 Out
FLAG -672 -1520 0
FLAG -496 -1632 I_demag
IOPIN -496 -1632 Out
FLAG 784 -1680 0
FLAG 832 -1792 I_min_demag
FLAG -1856 -3344 Doff_0
FLAG -1568 -2224 CCM_Ind_V
FLAG -1648 -4320 0
FLAG -1392 -4432 mag
FLAG -1472 -4320 0
FLAG -1456 -1168 0
FLAG -368 -2912 CCM_raw
FLAG -1152 -3552 Don_1
FLAG -1680 -1520 0
FLAG -1584 -1632 Ind_V
FLAG -1648 -4048 0
FLAG -1376 -4160 demag
FLAG -1472 -4048 0
FLAG -1744 -2768 0
FLAG -1728 -2880 CCM_test
FLAG -976 -2464 0
FLAG -928 -2752 tst1
FLAG -976 -2640 0
FLAG -400 -2768 tst2
FLAG -448 -2656 0
FLAG -640 -2480 0
FLAG -1664 -2048 0
FLAG -1264 -2048 0
FLAG -1104 -2048 0
FLAG -1824 -4384 V_mag
IOPIN -1824 -4384 In
FLAG -1792 -4112 V_demag
IOPIN -1792 -4112 In
FLAG -1232 -1168 0
FLAG -1360 -2128 0
FLAG -1664 -1744 0
FLAG -1344 -1856 Rs
FLAG -1472 -1760 0
DATAFLAG -1376 -1312 ""
DATAFLAG -1152 -1312 ""
SYMBOL res -960 -4432 R0
SYMATTR InstName R3
SYMATTR Value 1G
SYMBOL bv -944 -4240 R0
WINDOW 3 49 63 Left 2
WINDOW 0 49 38 Left 2
SYMATTR Value V=  V(mag) * {D_min / (Fs * L ) }
SYMATTR InstName B6
SYMBOL bv -944 -4064 R0
WINDOW 3 45 73 Left 2
WINDOW 0 42 44 Left 2
SYMATTR Value V=  max( V(I_pk_raw), V(I_pk_min)  )
SYMATTR InstName B10
SYMBOL bv -704 -4416 R0
WINDOW 3 45 56 Left 2
WINDOW 0 43 32 Left 2
SYMATTR Value V=  ( V(Vc) - {SlopeAmp} * V(don_2) ) / {Ri}
SYMATTR InstName B26
SYMBOL bv -1888 -3552 R0
WINDOW 3 54 81 Left 2
WINDOW 0 52 49 Left 2
SYMATTR Value V = {Fs * L} * V(I_pk) / V(mag)
SYMATTR InstName B21
SYMBOL bv -1888 -3344 R0
WINDOW 3 65 81 Left 2
WINDOW 0 58 41 Left 2
SYMATTR Value V = {Fs * L} * V(I_pk) / (V(demag) + 1u)
SYMATTR InstName B11
SYMBOL bv -976 -2912 R0
WINDOW 3 53 99 Left 2
WINDOW 0 50 64 Left 2
SYMATTR Value V= if (  V(CCM_test)  > 1 , 1, 0  )
SYMATTR InstName B12
SYMBOL res -608 -2928 R90
WINDOW 0 -3 55 VBottom 2
WINDOW 3 36 51 VTop 2
SYMATTR InstName R7
SYMATTR Value {100*R_lp}
SYMBOL cap -464 -2896 R0
WINDOW 0 38 10 Left 2
WINDOW 3 40 36 Left 2
SYMATTR InstName C2
SYMATTR Value 10p
SYMBOL bv -1216 -3552 R0
WINDOW 3 -73 -49 Left 2
WINDOW 0 46 49 Left 2
SYMATTR Value V= limit( V(demag) / ( V(mag) + V(demag)  ), {D_min}, {D_max} )
SYMATTR InstName B14
SYMBOL bv -1216 -3344 R0
WINDOW 3 221 89 Right 2
WINDOW 0 54 54 Left 2
SYMATTR Value V=  1- V(Don_1)
SYMATTR InstName B15
SYMBOL bv -336 -3648 R0
WINDOW 3 -22 184 Left 2
WINDOW 0 -18 153 Left 2
SYMATTR Value V= limit(  min( V(Don_1), V(Don_0)  ),  {D_min}, {D_max} )
SYMATTR InstName B16
SYMBOL res -160 -3664 R90
WINDOW 0 -3 55 VBottom 2
WINDOW 3 36 51 VTop 2
SYMATTR InstName R17
SYMATTR Value {1*R_lp}
SYMBOL cap -144 -3632 R0
WINDOW 0 38 10 Left 2
WINDOW 3 40 36 Left 2
SYMATTR InstName C10
SYMATTR Value 10p
SYMBOL bv -336 -3376 R0
WINDOW 3 -7 199 Left 2
WINDOW 0 -18 163 Left 2
SYMATTR Value V = min (  V(Doff_1), V(Doff_0)  )
SYMATTR InstName B18
SYMBOL res -160 -3392 R90
WINDOW 0 -3 55 VBottom 2
WINDOW 3 36 51 VTop 2
SYMATTR InstName R18
SYMATTR Value {1*R_lp}
SYMBOL cap -144 -3360 R0
WINDOW 0 38 10 Left 2
WINDOW 3 40 36 Left 2
SYMATTR InstName C11
SYMATTR Value 10p
SYMBOL bv 784 -2000 R0
WINDOW 3 46 83 Left 2
WINDOW 0 49 51 Left 2
SYMATTR Value V= V(demag) * V(Doff_2) / {L * Fs}
SYMATTR InstName B23
SYMBOL bv -96 -2112 R0
WINDOW 3 44 73 Left 2
WINDOW 0 45 46 Left 2
SYMATTR Value V= V(I_pk) - V(delta_I_mag)
SYMATTR InstName B24
SYMBOL bv -672 -2112 R0
WINDOW 3 44 71 Left 2
WINDOW 0 42 45 Left 2
SYMATTR Value V= V(mag) * V(Don_2) / {L * Fs}
SYMATTR InstName B25
SYMBOL bv -672 -1872 R0
WINDOW 3 42 80 Left 2
WINDOW 0 42 49 Left 2
SYMATTR Value V= ( V(I_min_mag) + V(delta_I_mag)/2  ) * V(Don_2)
SYMATTR InstName B28
SYMBOL bv -672 -1632 R0
WINDOW 3 46 76 Left 2
WINDOW 0 47 54 Left 2
SYMATTR Value V= ( V(I_pk) - V(delta_I_mag)/2  ) * V(Doff_2)
SYMATTR InstName B29
SYMBOL bv 784 -1792 R0
WINDOW 3 42 76 Left 2
WINDOW 0 47 49 Left 2
SYMATTR Value V= V(I_pk) - V(delta_I_mag)
SYMATTR InstName B30
SYMBOL cap -1280 -2208 R0
WINDOW 0 61 21 Left 2
WINDOW 3 56 43 Left 2
SYMATTR InstName Cs1
SYMATTR Value { Cs }
SYMBOL ind -1120 -2192 R0
SYMATTR InstName L1
SYMATTR Value {L}
SYMATTR SpiceLine Rser=0.1u
SYMBOL bv -1648 -4432 R0
WINDOW 3 277 173 Right 2
WINDOW 0 -9 150 Left 2
SYMATTR Value V=  V(V_mag) - V(Ind_V)
SYMATTR InstName B5
SYMBOL res -1504 -4448 R90
WINDOW 0 -7 58 VBottom 2
WINDOW 3 32 58 VTop 2
SYMATTR InstName R11
SYMATTR Value {1 * R_lp}
SYMBOL cap -1488 -4400 R0
SYMATTR InstName C4
SYMATTR Value 10p
SYMBOL voltage -1456 -1296 R0
SYMATTR InstName V1
SYMATTR Value {Cs}
SYMBOL bv -1680 -1632 R0
WINDOW 0 49 36 Left 2
WINDOW 3 44 68 Left 2
SYMATTR InstName B4
SYMATTR Value V= limit( V(CCM_Ind_V), -1*V(V_demag) + 1m, (V(V_mag) - 1m) )
SYMBOL bv -1648 -4160 R0
WINDOW 3 314 181 Right 2
WINDOW 0 -8 152 Left 2
SYMATTR Value V=  V(V_demag) + V(Ind_V)
SYMATTR InstName B20
SYMBOL res -1504 -4176 R90
WINDOW 0 -7 58 VBottom 2
WINDOW 3 32 58 VTop 2
SYMATTR InstName R13
SYMATTR Value {R_lp}
SYMBOL cap -1488 -4128 R0
SYMATTR InstName C8
SYMATTR Value 10p
SYMBOL bv -1744 -2880 R0
WINDOW 3 51 65 Left 2
WINDOW 0 54 36 Left 2
SYMATTR Value V= limit( V(Don_0) + V(Doff_0), 0, 2)
SYMATTR InstName B7
SYMBOL bv -976 -2576 R0
WINDOW 3 53 148 Left 2
WINDOW 0 54 106 Left 2
SYMATTR Value V= if( sync > 0.5, 1, if( V(CCM_test) > 1,  V(tst1), V(tst2) )  )
SYMATTR InstName B13
SYMBOL bv -976 -2752 R0
WINDOW 3 62 77 Left 2
WINDOW 0 60 42 Left 2
SYMATTR Value V= if( V(CCM_raw) > 0.9, 1, 0 )
SYMATTR InstName B19
SYMBOL bv -448 -2768 R0
WINDOW 3 63 83 Left 2
WINDOW 0 68 49 Left 2
SYMATTR Value V= if( V(CCM_raw) < 0.1, 0, 1 )
SYMATTR InstName B27
SYMBOL res -688 -2592 R90
WINDOW 0 -3 55 VBottom 2
WINDOW 3 36 51 VTop 2
SYMATTR InstName R1
SYMATTR Value {10*R_lp}
SYMBOL cap -656 -2560 R0
WINDOW 0 38 10 Left 2
WINDOW 3 40 36 Left 2
SYMATTR InstName C5
SYMATTR Value 10p
SYMBOL bi -1664 -2096 R180
WINDOW 0 -92 38 Left 2
WINDOW 3 -47 15 Right 2
SYMATTR InstName B32
SYMATTR Value I = V(I_min_mag)
SYMBOL res -1280 -2160 R0
WINDOW 0 62 40 Left 2
WINDOW 3 59 73 Left 2
SYMATTR InstName Rs1
SYMATTR Value R = V(Rs)
SYMBOL bv -1664 -1856 R0
WINDOW 0 45 54 Left 2
WINDOW 3 239 84 Left 2
SYMATTR InstName B1
SYMATTR Value V= if( V(CCM) > 0.5, {Rs_CCM}, {Rs_DCM}  )
SYMBOL bv -1232 -1296 R0
WINDOW 0 45 54 Left 2
WINDOW 3 43 81 Left 2
SYMATTR InstName B2
SYMATTR Value V= V(Rs)
SYMBOL res -1488 -1872 R90
WINDOW 0 10 125 VBottom 2
WINDOW 3 -25 23 VTop 2
SYMATTR InstName R2
SYMATTR Value {100*R_lp}
SYMBOL cap -1488 -1840 R0
WINDOW 0 38 10 Left 2
WINDOW 3 40 36 Left 2
SYMATTR InstName C1
SYMATTR Value 10p
TEXT 96 -4344 Left 2 !.param R_lp = 0.1meg/Fs
TEXT 96 -4560 Left 2 !.param L = 10u
TEXT 96 -4592 Left 2 !.param Fs = 200k
TEXT 96 -4464 Left 2 !.param D_min = 0.05
TEXT 96 -4432 Left 2 !.param D_max = 0.90
TEXT 96 -4496 Left 2 !.param SlopeAmp =0.2
TEXT 96 -4528 Left 2 !.param Ri = 0.25
TEXT 96 -4624 Left 2 !.param sync = 0
TEXT 192 -1664 Left 2 ;Drawn : Mark Dimattina
TEXT 184 -1752 Left 4 ;Title : PWM-CM3
TEXT 192 -1600 Left 2 ;Rev: 0.02
TEXT 192 -1632 Left 2 ;Date:10/06/2024
TEXT 192 -1568 Left 2 ;M.J.Dimattina@ieee.org
TEXT -1520 -2008 Left 2 !.param Cs = { 1 / ( L * (pi * Fs)**2 ) }
TEXT -800 -4088 Left 2 ;Peak Current
TEXT -1888 -3840 Left 2 ;V = L di/dt
TEXT -1888 -3808 Left 2 ;dt = L * di / V
TEXT 960 -2008 Left 2 ;delta I   during demag
TEXT -680 -2176 Left 2 ;di =V * dt /  L
TEXT -496 -2120 Left 2 ;delta I   during mag
TEXT -648 -1928 Left 2 ;Magentizing Current
TEXT -640 -1680 Left 2 ;De-magentizing Current
TEXT -1936 -3608 Left 2 ;On Time Duty Cycle
TEXT -1936 -3392 Left 2 ;Off Time Duty Cycle
TEXT -1768 -2928 Left 2 ;When Don + Doff > 1
TEXT -1264 -3704 Left 2 ;Don_1 = Don_0 / ( Don_0 + Doff_0 )
TEXT -1256 -3656 Left 2 ;simplifies to ->
TEXT -1888 -3752 Left 5 ;DCM
TEXT -1176 -3760 Left 5 ;CCM
TEXT -264 -3776 Left 5 ;Mode Toggle
TEXT -1344 -3072 Left 5 ;Mode Selection
TEXT -712 -2256 Left 5 ;Current Calculation
TEXT -1672 -2344 Left 5 ;Induced Inductor Voltage
TEXT -928 -4536 Left 5 ;Peak Current
TEXT -928 -2976 Left 2 ;Hysteresis to improve transient simulation speed
TEXT -1736 -4528 Left 5 ;Inductor Voltage
TEXT -1736 -4584 Left 5 ;Mag / Demag
TEXT -1520 -1968 Left 2 !.param Rs_CCM = { sqrt( L / Cs ) / Q }
TEXT -1720 -1968 Left 2 !.param Q = 10
TEXT -1520 -1928 Left 2 !.param Rs_DCM = { sqrt( L / Cs ) / 0.5 }
RECTANGLE Normal 640 -1472 -2016 -4704 2

The netlist it stands for:
* BuckBoost_negOutput.asc
L1 c N001 {L} Rser=1m
R7 0 N001 1m
Cout N003 out 220µ
R11 0 out R = V(Rload)
R12 0 N004 {Rdiv1}
R13 N004 out {Rdiv2}
V3 a 0 {Vin}
R15 0 N003 {Cesr}
XX3 Vi Vc transconerroramp params: C_comp2 = {C_comp2}, C_comp = {C_comp}, R_comp = {R_comp}, Pos = 3, Neg = 0, Gain = {TA_Gain}, Vref = {Vref}
C1 0 0 100n
V1 Rload 0 PULSE({R_idle} {R_step} 2m 1u 1u 6m 16m)
R18 N002 out 1µ
XX1 Vc a c N002 idealbuck params: L = {L}, Fs = {Fs}, Ri = {Ri} , SlopeAmp = {Se / Fs}, D_min = {clampL}, D_max = {clampH}
E2 Vi 0 N004 out 1
Cin a out 220µ
R2 0 CM3-c 1m
Cout1 N006 CM3-out 220µ
R3 0 CM3-out R = V(Rload)
R4 0 N007 {Rdiv1}
R5 N007 CM3-out {Rdiv2}
V2 CM3-a 0 {Vin}
R8 0 N006 {Cesr}
R9 N005 CM3-out 1µ
XX2 CM3-Vi CM3-Vc transconerroramp params: C_comp2 = {C_comp2}, C_comp = {C_comp}, R_comp = {R_comp}, Pos = 3, Neg = 0, Gain = {TA_Gain}, Vref = {Vref}
V6 CM3-Vi CM3-Vo SINE(0) AC {AC_amp} 0
C2 0 0 100n
E3 CM3-Vo 0 N007 CM3-out 1
Cin1 CM3-a CM3-out 220µ
XX4 CM3-Vc CM3-a CM3-c N005 buck_cm3 params: sync = 0, L = {L}, Fs = {Fs}, Ri = {Ri} , SlopeAmp = {Se / Fs}, D_min = {clampL}, D_max = {clampH}

* block symbol definitions
.subckt transconerroramp Vi Vc
G1 0 Vc ref_Av N002 { Gain }
V1 ref_Av 0 {Vref}
C1 Vc 0 {C_comp2}
C2 N003 0 {C_comp}
R1 Vc N003 {R_comp}
B1 Vc 0 I= if( V(Vc)  > {Pos}, {alpha} * ( V(Vc) -  {Pos} ), 0 )
B2 0 Vc I= if( V(Vc)  < {Neg}, {alpha} * (  {Neg} - V(Vc)  ), 0 )
R2 Vc 0 1000Meg
C3 N002 0 1p
R3 N002 N001 10k
E1 N001 0 Vi_lim 0 1
B3 Vi_lim 0 V= limit(  V(Vi), {Neg}, {Pos}  )
R4 Vi 0 10Meg
.param alpha = 5m
.param R_comp =1k
.param C_comp = 1n
.param C_comp2 = 1p
* B1
* B2
* Drawn : Mark Dimattina
* Title : Transconductance Error Amp
* Rev: 0.04
* Date: 25/07/2017
* M.J.Dimattina@ieee.org
.param Pos = 4
.param Neg = 0
.param Vref = 2.5
.param Gain = 135u
.ends transconerroramp

.subckt idealbuck Vc a c p
H1 I_L 0 V1 1
V1 N003 Sw 0
A1 set trip_reset 0 0 0 q_bar q 0 SRFLOP
V2 set 0 PULSE(0 1 0 {Trise_fall} {Trise_fall} {Ton_min} {Period})
V3 reset 0 PULSE(0 1 {Ton_max} {Trise_fall} {Trise_fall} {Trise_fall} {Period})
H2 I_out 0 V5 1
R8 N001 I_out 100
C5 N001 0 100n
V4 ramp 0 PULSE(0 {SlopeAmp} 0 {Period - 2*Trise_fall} {Trise_fall} {Trise_fall} {Period})
R9 N003 a R = V(R_fet)
B1 sense_slope 0 V={Ri}*V(I_sense) + V(ramp)
V5 Sw c 0
R10 N002 N001 1000
C7 N002 0 10n
A2 0 reset 0 trip2 0 0 trip_reset 0 OR
B2 N007 0 V=if( V(sense_slope) > V(Vc), 1, 0)
R11 trip N007 100
C8 trip 0 10p
B3 R_fet 0 V=if( V(q) > 0.5, 1m, 100k)
R2 p Sw R=V(Rdiode)
B4 Rdiode 0 V= if( V(Sw) < V(p), 1m, 100k )
R1 N006 N005 300
C3 N005 0 10p
E1 N004 0 N005 0 1
R3 N004 I_sense 300
C4 I_sense 0 10p
B5 N006 0 V= limit( V(I_L), 0, 20)
B6 trip2 0 V=  V(trip) - V(set)
B7 On_time 0 V=if( V(q) > 0.5, V(On-time-ramp), 0 )
V6 On-time-ramp 0 PULSE(0 {1} 0 {Period - 2*Trise_fall} {Trise_fall} {Trise_fall} {Period})
.param SlopeAmp = 0.5
.param Trise_fall = 1n
.param Fs = 100k
.param Period = {1/Fs}
.param cycles = 50000
.param Ton_min = {D_min/Fs}
.param Ton_max = {D_max/Fs}
.param D_min = 5
.param D_max = 90
.param Ri = 0.25
.param FET_on_R = 1m
* Drawn : Mark Dimattina
* Title : IdealBuck
* Rev: 0.04
* Date: 25/07/2017
* M.J.Dimattina@ieee.org
.ends idealbuck

.subckt buck_cm3 Vc A C P
Bin A C I=  V(I_mag)
Bout p C I=  V(I_demag)
XX1 Vc V_mag V_demag I_mag I_demag pwm_cm3 params: sync = {sync}, L = {L}, Fs = {Fs}, Ri = {Ri} , SlopeAmp = {SlopeAmp}, D_min = {D_min}, D_max = {D_max}
B1 V_mag 0 V= V(a, c)
B2 V_demag 0 V= V(c, p)
.param L = 10u
.param Fs = 200k
.param D_min = 0.05
.param D_max = 0.90
.param SlopeAmp =0.2
.param Ri = 0.25
.param sync = 0
* Drawn : Mark Dimattina
* Title : Buck-CM3
* Rev: 0.01
* Date: 22/05/2024
* M.J.Dimattina@ieee.org
* Buck
.ends buck_cm3

.subckt pwm_cm3 Vc V_mag V_demag I_mag I_demag
R3 Vc 0 1G
B6 I_Pk_min 0 V=  V(mag) * {D_min / (Fs * L ) }
B10 I_pk 0 V=  max( V(I_pk_raw), V(I_pk_min)  )
B26 I_pk_raw 0 V=  ( V(Vc) - {SlopeAmp} * V(don_2) ) / {Ri}
B21 Don_0 0 V = {Fs * L} * V(I_pk) / V(mag)
B11 Doff_0 0 V = {Fs * L} * V(I_pk) / (V(demag) + 1u)
B12 N005 0 V= if (  V(CCM_test)  > 1 , 1, 0  )
R7 CCM_raw N005 {100*R_lp}
C2 CCM_raw 0 10p
B14 Don_1 0 V= limit( V(demag) / ( V(mag) + V(demag)  ), {D_min}, {D_max} )
B15 Doff_1 0 V=  1- V(Don_1)
B16 N003 0 V= limit(  min( V(Don_1), V(Don_0)  ),  {D_min}, {D_max} )
R17 Don_2 N003 {1*R_lp}
C10 Don_2 0 10p
B18 N004 0 V = min (  V(Doff_1), V(Doff_0)  )
R18 Doff_2 N004 {1*R_lp}
C11 Doff_2 0 10p
B23 delta_I_demag 0 V= V(demag) * V(Doff_2) / {L * Fs}
B24 I_min_mag 0 V= V(I_pk) - V(delta_I_mag)
B25 delta_I_mag 0 V= V(mag) * V(Don_2) / {L * Fs}
B28 I_mag 0 V= ( V(I_min_mag) + V(delta_I_mag)/2  ) * V(Don_2)
B29 I_demag 0 V= ( V(I_pk) - V(delta_I_mag)/2  ) * V(Doff_2)
B30 I_min_demag 0 V= V(I_pk) - V(delta_I_mag)
Cs1 CCM_Ind_V P001 { Cs }
L1 CCM_Ind_V 0 {L} Rser=0.1u
B5 N001 0 V=  V(V_mag) - V(Ind_V)
R11 mag N001 {1 * R_lp}
C4 mag 0 10p
V1 N008 0 {Cs}
B4 Ind_V 0 V= limit( V(CCM_Ind_V), -1*V(V_demag) + 1m, (V(V_mag) - 1m) )
B20 N002 0 V=  V(V_demag) + V(Ind_V)
R13 demag N002 {R_lp}
C8 demag 0 10p
B7 CCM_test 0 V= limit( V(Don_0) + V(Doff_0), 0, 2)
B13 N006 0 V= if( sync > 0.5, 1, if( V(CCM_test) > 1,  V(tst1), V(tst2) )  )
B19 tst1 0 V= if( V(CCM_raw) > 0.9, 1, 0 )
B27 tst2 0 V= if( V(CCM_raw) < 0.1, 0, 1 )
R1 CCM N006 {10*R_lp}
C5 CCM 0 10p
B32 0 CCM_Ind_V I = V(I_min_mag)
Rs1 P001 0 R = V(Rs)
B1 N007 0 V= if( V(CCM) > 0.5, {Rs_CCM}, {Rs_DCM}  )
B2 N009 0 V= V(Rs)
R2 Rs N007 {100*R_lp}
C1 Rs 0 10p
.param R_lp = 0.1meg/Fs
.param L = 10u
.param Fs = 200k
.param D_min = 0.05
.param D_max = 0.90
.param SlopeAmp =0.2
.param Ri = 0.25
.param sync = 0
* Drawn : Mark Dimattina
* Title : PWM-CM3
* Rev: 0.02
* Date:10/06/2024
* M.J.Dimattina@ieee.org
.param Cs = { 1 / ( L * (pi * Fs)**2 ) }
* Peak Current
* V = L di/dt
* dt = L * di / V
* delta I   during demag
* di =V * dt /  L
* delta I   during mag
* Magentizing Current
* De-magentizing Current
* On Time Duty Cycle
* Off Time Duty Cycle
* When Don + Doff > 1
* Don_1 = Don_0 / ( Don_0 + Doff_0 )
* simplifies to ->
* DCM
* CCM
* Mode Toggle
* Mode Selection
* Current Calculation
* Induced Inductor Voltage
* Peak Current
* Hysteresis to improve transient simulation speed
* Inductor Voltage
* Mag / Demag
.param Rs_CCM = { sqrt( L / Cs ) / Q }
.param Q = 10
.param Rs_DCM = { sqrt( L / Cs ) / 0.5 }
.ends pwm_cm3

.param clampL = 0.1
.param clampH = 0.99
* .ac oct 100 10 1meg
.param L = 37.5u
.param Fs = 50k
.param Ri = 0.33
.param Se = {rAmp * Fs}
* Compensation Ramp  - V/s
* R sense  - Ohms
* Switching Freq - Hz
* Inductance - H
* Duty Cycle Limits
* PWM-CM Parameters
.param Vref = 2.5
.param TA_Gain = 135u
.param C_comp = 8n
.param R_comp = 20k
.ic V(Vi) = {Vref}
.ic V(out) = {-1*Vout}
.ic V(Vc) = 1.248
.param I_idle = { abs( Vout / 3 ) }
.param I_step = { abs( Vout / 30 ) }
.param Vout = 5
.param R_idle = { Vout / I_idle}
.param R_step = { Vout / I_step }
.param Vin = 6
.param Rdiv2 = 10k
.param Rdiv1 = Rdiv2 * (Vout - Vref) / Vref
.param rAmp = 0.5m
* Error Amp Parameters
* Circuit Parameters
* Drawn : Mark Dimattina
* Title : BuckBoost_negOutput
* Rev: 0.01
* Date: 02/09/2017
* M.J.Dimattina@ieee.org
.ic I(L1) = I_idle
* .step param Vout 5 7 2
.param  AC_amp = 0.01
.tran 0 12m 0
.param Cesr = 1m
.param C_comp2 = 200p
.ic V(c) = 10m
.backanno
.end

* Results of the author's LTspice run, read from the files saved beside the schematic
* Operating Point, zero values left out:
*   V(c) = 10 mV
*   V(n001) = 1.667 mV
*   V(out) = -5 V
*   V(n004) = -2.5 V
*   V(a) = 6 V
*   V(vc) = 1.248 V
*   V(vi) = 2.5 V
*   V(rload) = 3 V
*   V(n002) = -5 V
*   V(cm3-c) = 3.056 mV
*   V(cm3-out) = -4.998 V
*   V(n007) = -2.499 V
*   V(cm3-a) = 6 V
*   V(n005) = -4.998 V
*   V(cm3-vc) = 1.249 V
*   V(cm3-vi) = 2.499 V
*   V(cm3-vo) = 2.499 V
*   I(R3) = 1.666 A
*   I(R11) = 1.667 A
*   I(L1) = 1.667 A
*   I(R9) = -1.666 A
*   I(R5) = 249.9 µA
*   I(R4) = 249.9 µA
*   I(R2) = -3.056 A
*   I(R18) = 50.1 µA
*   I(R13) = 250 µA
*   I(R12) = 250 µA
*   I(R7) = -1.667 A
*   I(E3) = -249.9 nA
*   I(V6) = -249.9 nA
*   I(V2) = -1.39 A
*   I(V3) = -59.9 µA
*   Ix(x3:VI) = 250 nA
*   Ix(x3:VC) = 1.248 nA
*   Ix(x1:A) = 59.9 µA
*   Ix(x1:C) = -9.8 µA
*   Ix(x1:P) = -50.1 µA
*   Ix(x2:VI) = 249.9 nA
*   Ix(x2:VC) = -124.9 nA
*   Ix(x4:VC) = 124.9 nA
*   Ix(x4:A) = 1.39 A
*   Ix(x4:C) = -3.056 A
*   Ix(x4:P) = 1.666 A